# EasyEDA Pro project ax08.eprj, board ax08 lite
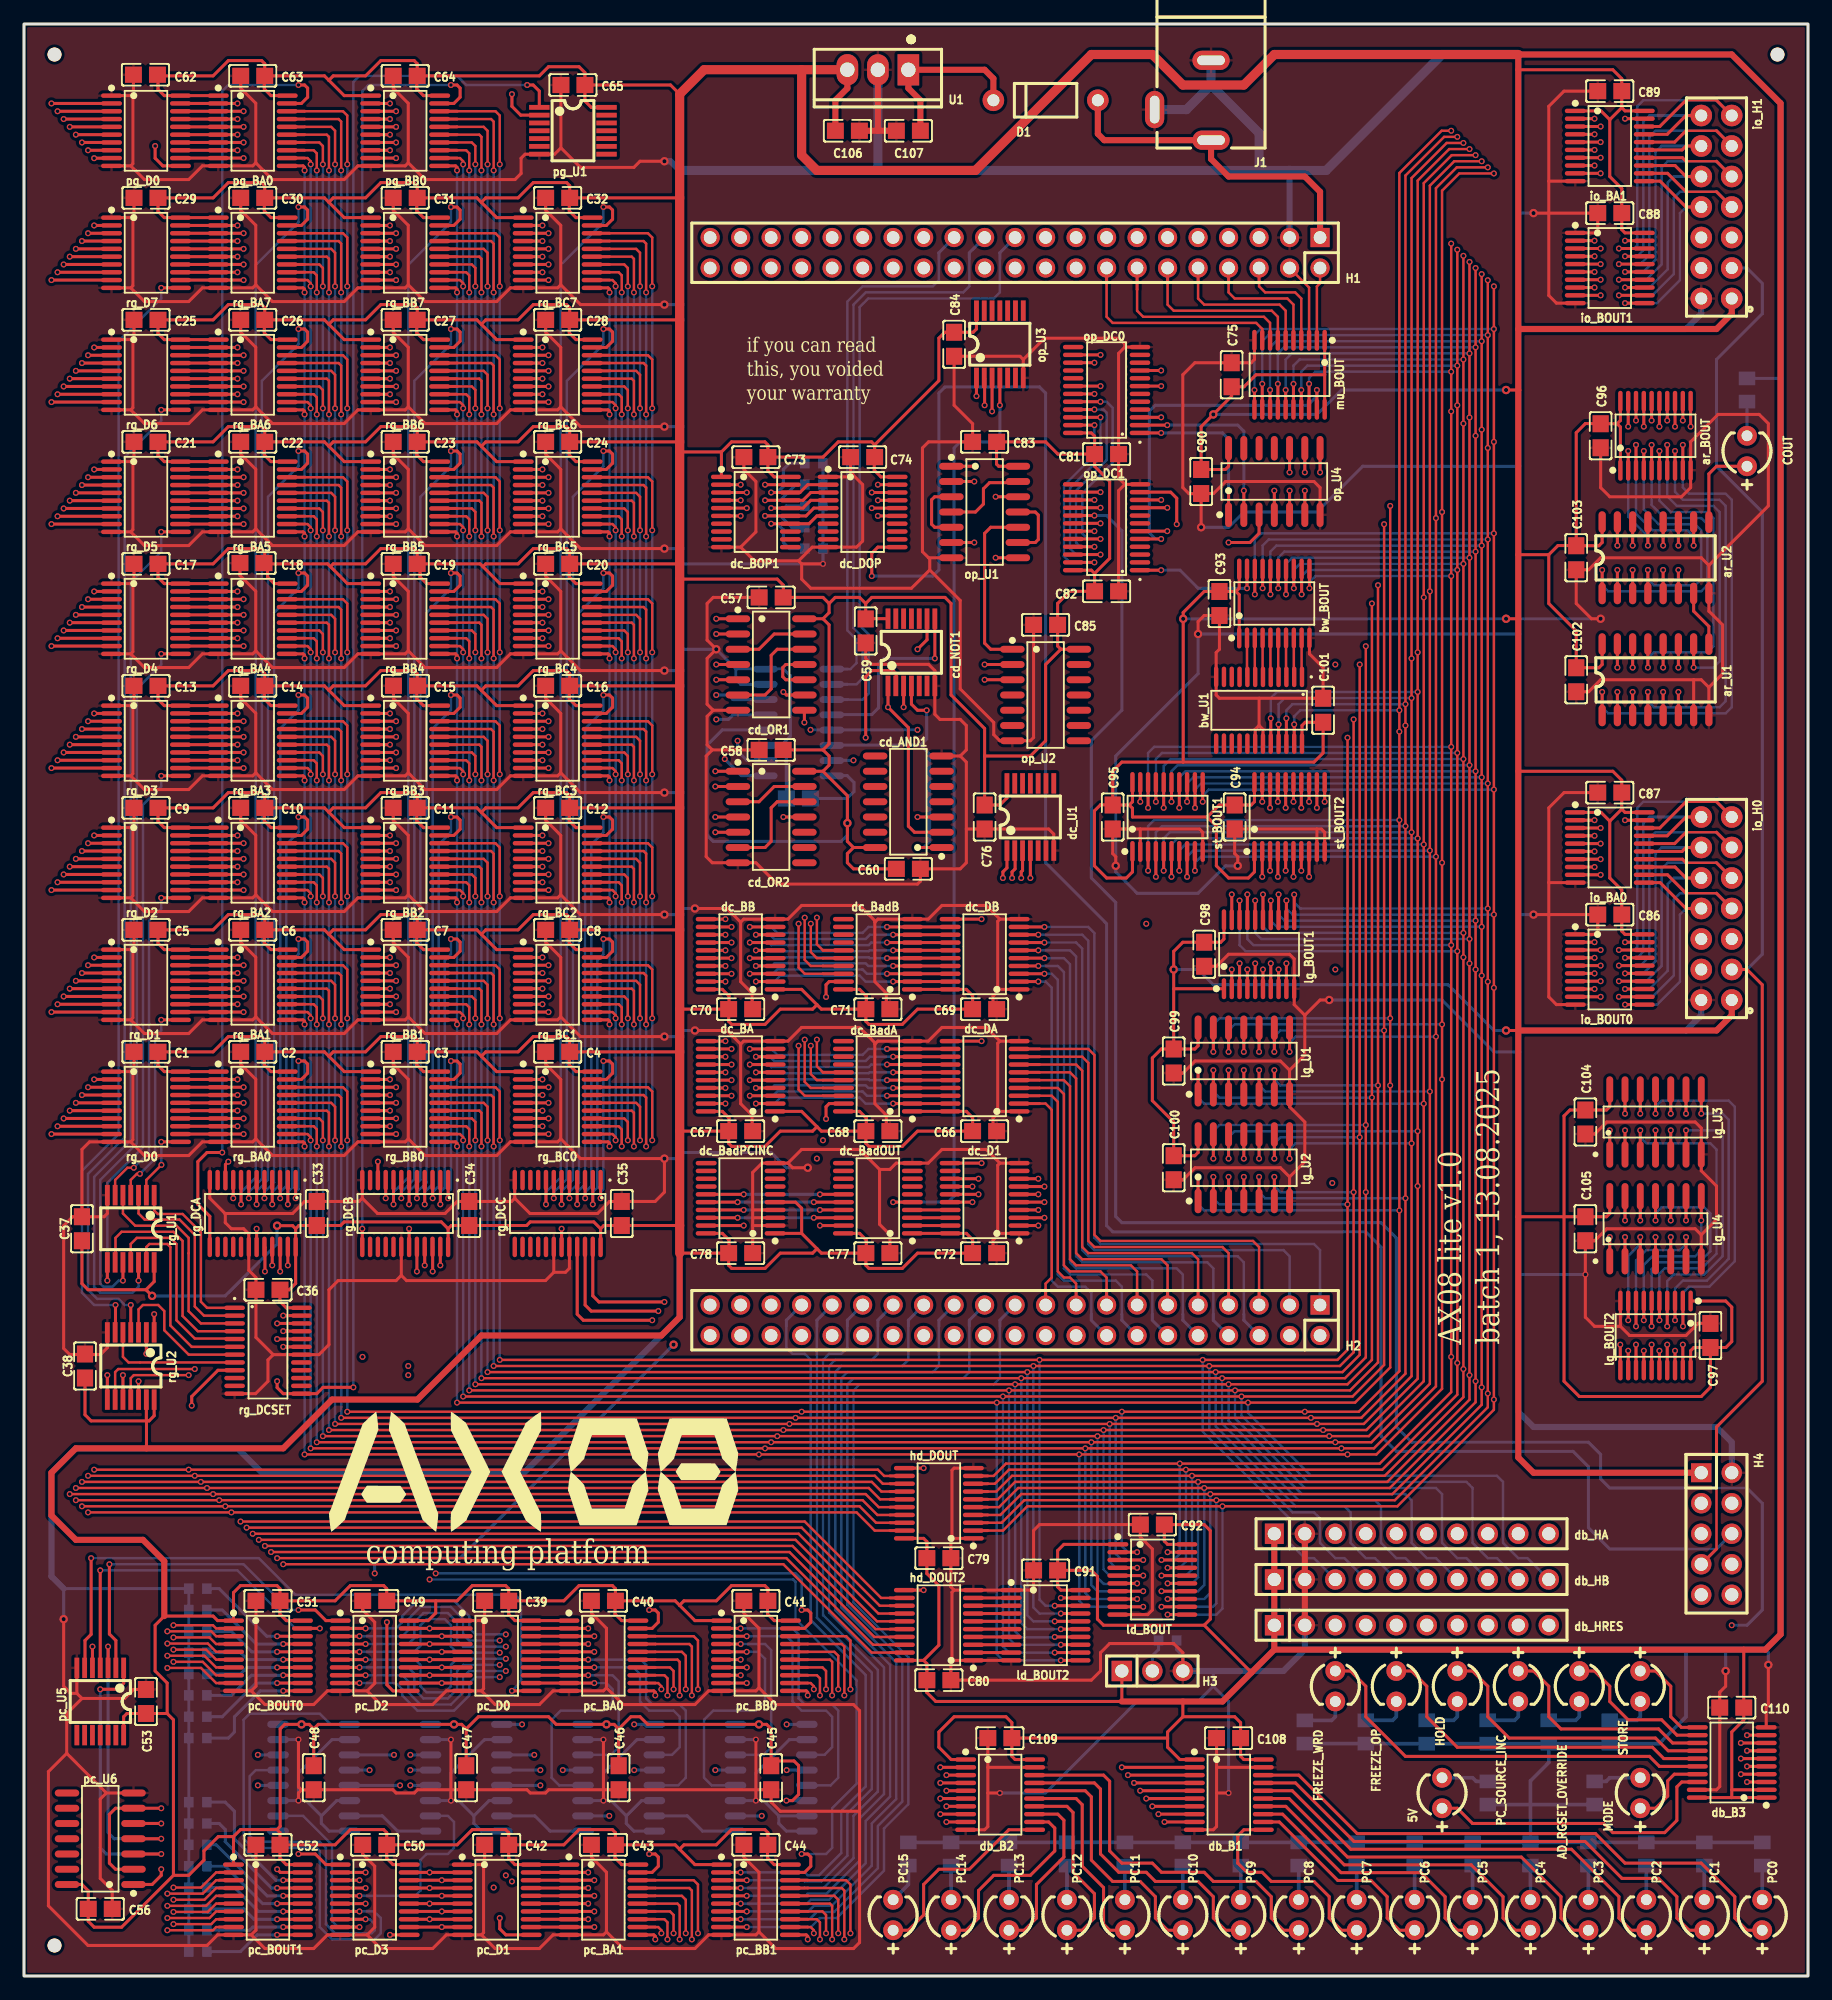
[diagram p43: board, top side]
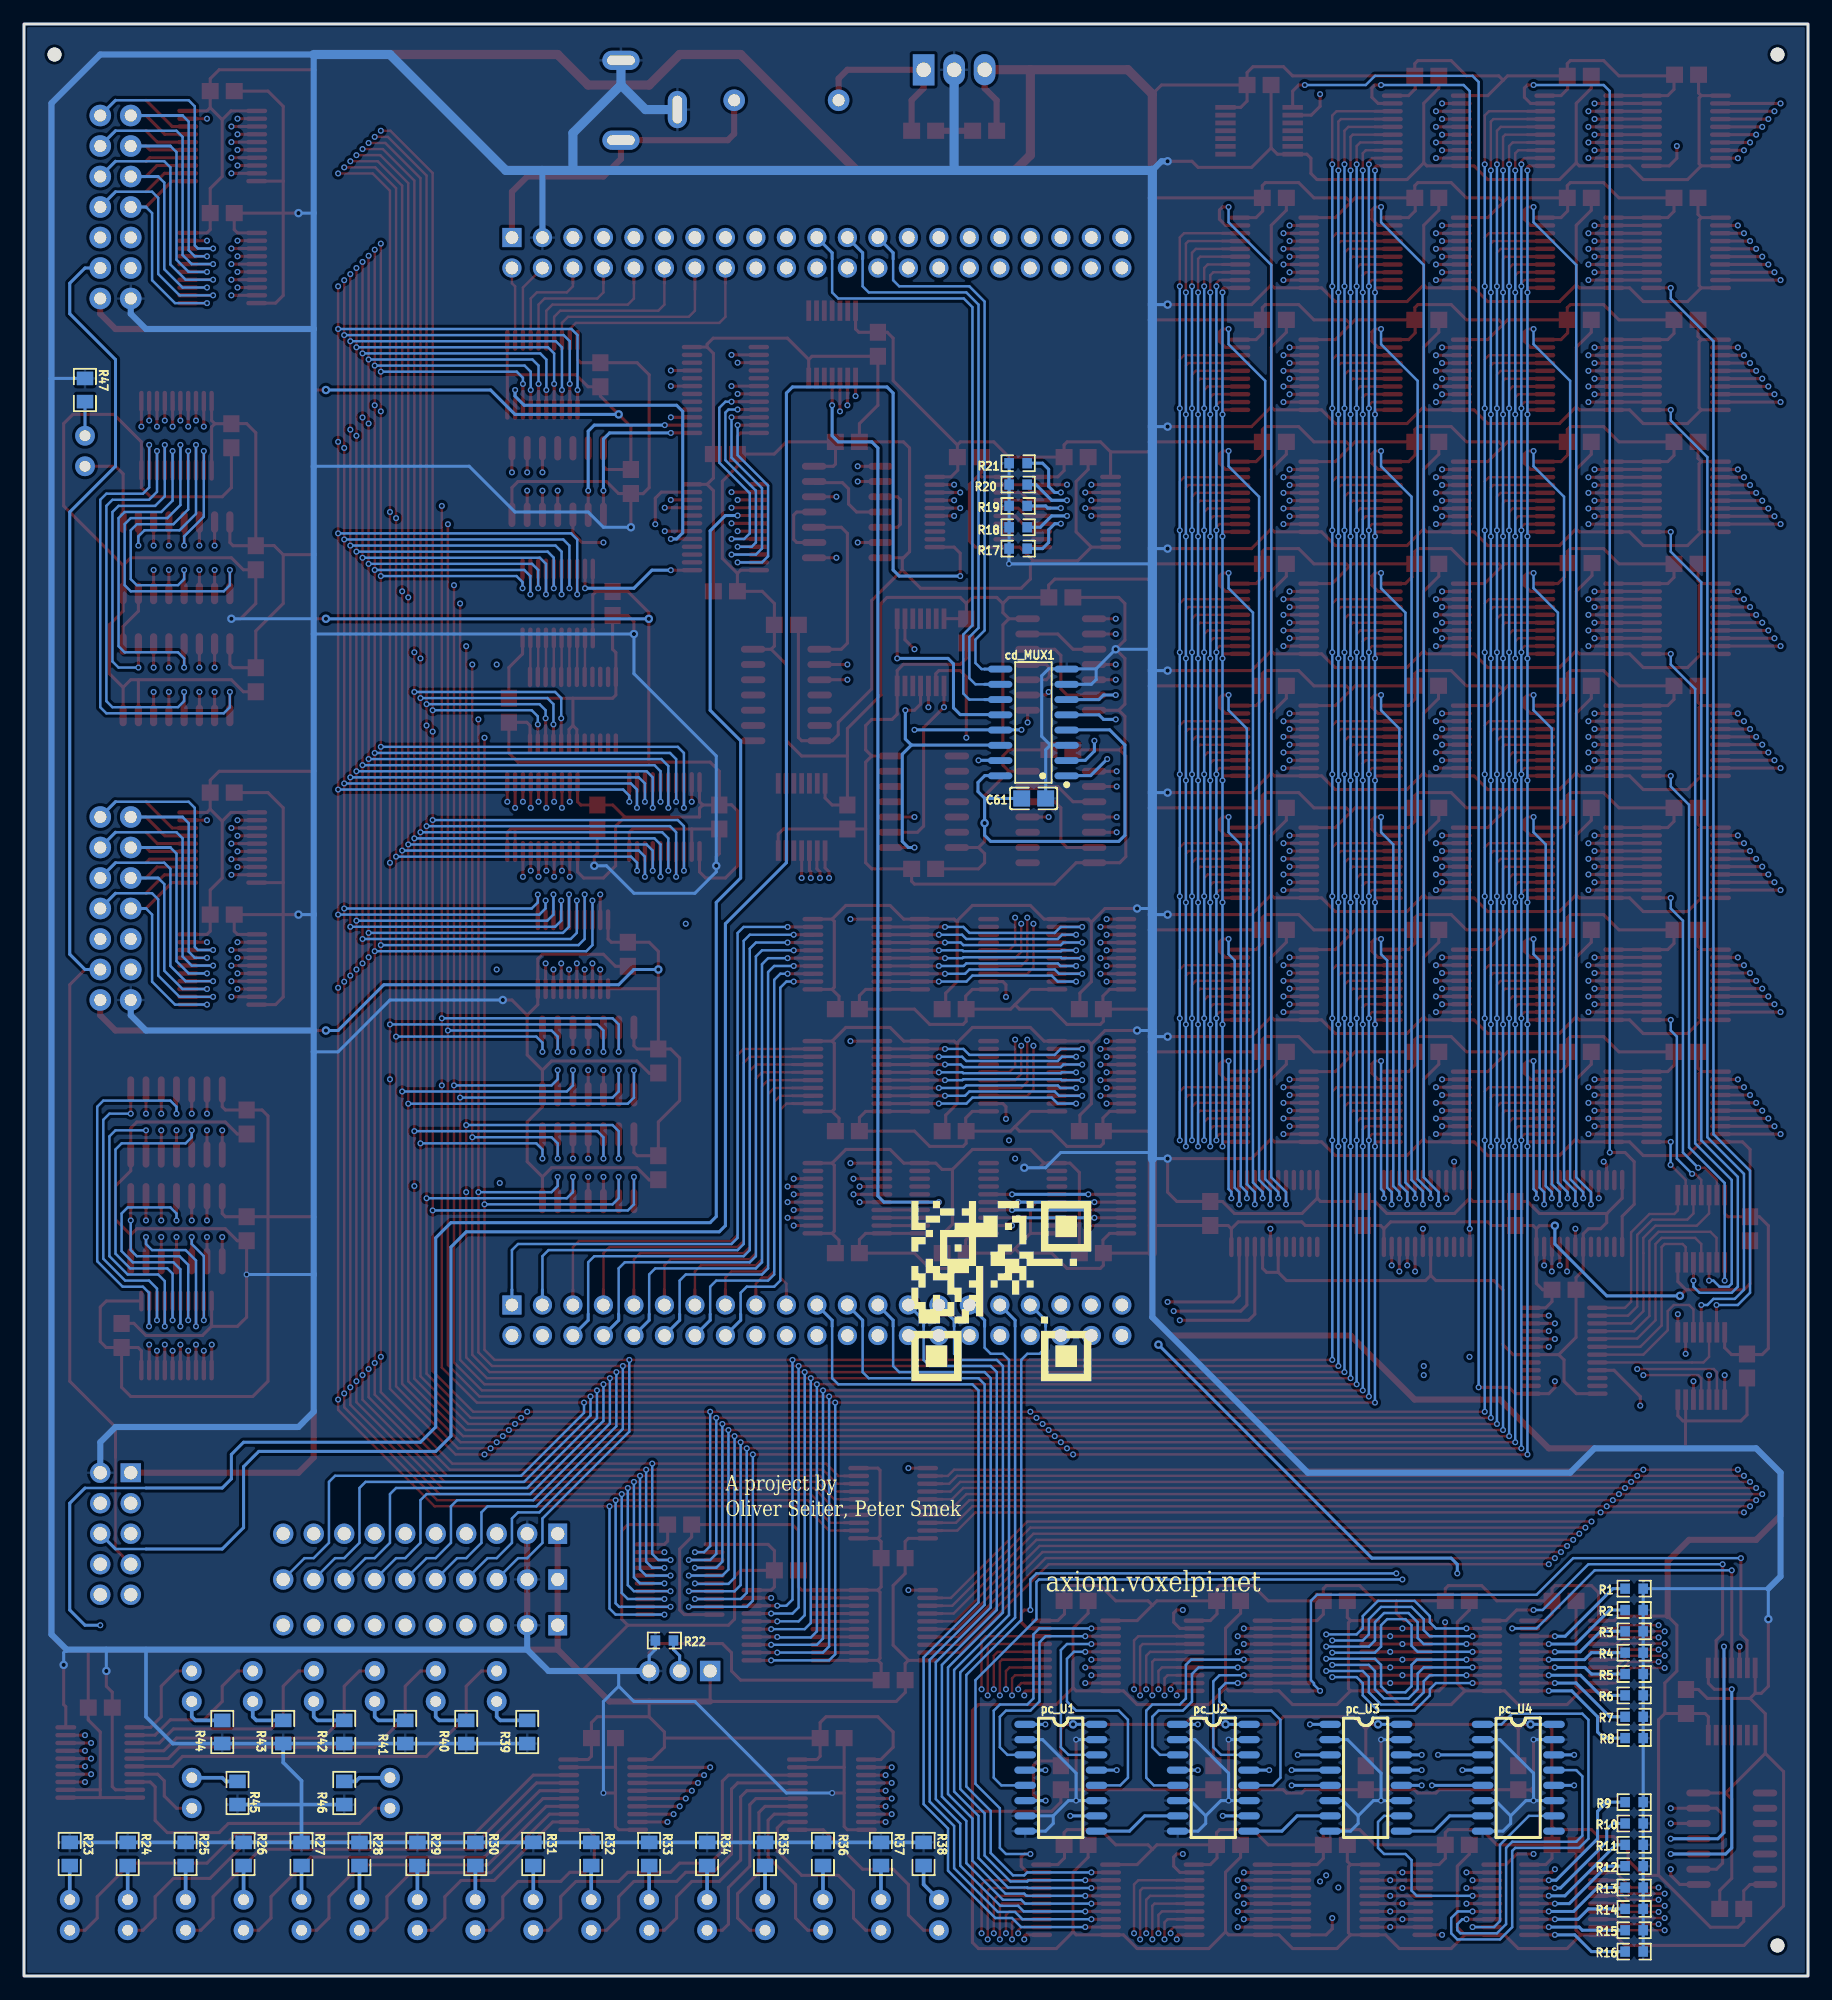
[diagram p44: board, bottom side, seen from below]

Outline 148.59 x 162.56 mm; copper layers: Top Layer, Inner1, Inner2, Bottom Layer. Coordinates in mm from the lower left corner of the outline.
Outline path: rectangle 0,162.56 148.59,0
Stack: Top Layer 0.035mm Outer layer thickness 1oz / Dielectric1 0.2104mm 7628 RC49% 8.6mil / Inner1 0.0152mm Inner layer thickness / Dielectric2 1.065mm 1.1mm H/HOZ Copper / Inner2 0.0152mm Inner layer thickness / Dielectric3 0.2104mm 7628 RC49% 8.6mil / Bottom Layer 0.035mm Outer layer thickness 1oz

## Design rules (mm)
template: JLCPCB Capability(Two Layers Board)
spacing copperThickness1oz (default): track to track 0.102, other pairs 0.152 to 0.3
spacing copperThickness2oz: track to track 0.203, other pairs 0.152 to 0.3
track width copperThickness1oz (default): min 0.127, default 0.254, max 2.54
track width copperThickness2oz: min 0.203, default 0.254, max 2.54
differential pair differentialPair (default): width min 0.127, default 0.254, max 2.54; gap min 0.152, default 0.152
via viaSize (default): diameter min 0.5, default 0.61, max 10; hole min 0.3, default 0.305, max 6.3

## Placement (name value [footprint] x y rotation side)
5V  DY-204UYGD-H38-A3  [LED-TH_BD4.0-P2.54-FD]  118.11 15.24 90 top
AD_RGSET_OVERRIDE  DY-204UYGD-H38-A3  [LED-TH_BD4.0-P2.54-FD]  129.54 24.13 270 top
ar_BOUT  74HC245PW,118  [TSSOP-20_L6.5-W4.4-P0.65-LS6.4-BL]  135.89 128.27 0 top
ar_U1  SN74LS283DR(LX)  [SOIC-16_L9.9-W3.9-P1.27-LS6.0-BL-1]  135.89 107.95 0 top
ar_U2  SN74LS283DR(LX)  [SOIC-16_L9.9-W3.9-P1.27-LS6.0-BL-1]  135.89 118.11 0 top
bw_BOUT  74HC245PW,118  [TSSOP-20_L6.5-W4.4-P0.65-LS6.4-BL]  104.14 114.3 0 top
bw_U1  SN74HC154PW(LX)  [TSSOP-24_L7.8-W4.4-P0.65-LS6.4-BL_1]  102.87 105.41 180 top
C1  100nF  [C0805]  10.16 76.96 0 top
C2  100nF  [C0805]  19.05 76.96 0 top
C3  100nF  [C0805]  31.75 76.96 0 top
C4  100nF  [C0805]  44.45 76.96 0 top
C5  100nF  [C0805]  10.16 87.12 0 top
C6  100nF  [C0805]  19.05 87.12 0 top
C7  100nF  [C0805]  31.75 87.12 0 top
C8  100nF  [C0805]  44.45 87.12 0 top
C9  100nF  [C0805]  10.16 97.28 0 top
C10  100nF  [C0805]  19.05 97.28 0 top
C11  100nF  [C0805]  31.75 97.28 0 top
C12  100nF  [C0805]  44.45 97.28 0 top
C13  100nF  [C0805]  10.16 107.44 0 top
C14  100nF  [C0805]  19.05 107.44 0 top
C15  100nF  [C0805]  31.77 107.45 0 top
C16  100nF  [C0805]  44.45 107.44 0 top
C17  100nF  [C0805]  10.16 117.6 0 top
C18  100nF  [C0805]  18.99 117.67 0 top
C19  100nF  [C0805]  31.75 117.6 0 top
C20  100nF  [C0805]  44.45 117.6 0 top
C21  100nF  [C0805]  10.16 127.76 0 top
C22  100nF  [C0805]  19.05 127.76 0 top
C23  100nF  [C0805]  31.75 127.76 0 top
C24  100nF  [C0805]  44.45 127.76 0 top
C25  100nF  [C0805]  10.16 137.92 0 top
C26  100nF  [C0805]  19.05 137.92 0 top
C27  100nF  [C0805]  31.75 137.92 0 top
C28  100nF  [C0805]  44.45 137.92 0 top
C29  100nF  [C0805]  10.16 148.08 0 top
C30  100nF  [C0805]  19.05 148.08 0 top
C31  100nF  [C0805]  31.75 148.08 0 top
C32  100nF  [C0805]  44.45 148.08 0 top
C33  100nF  [C0805]  24.38 63.5 90 top
C34  100nF  [C0805]  37.08 63.5 90 top
C35  100nF  [C0805]  49.78 63.5 90 top
C36  100nF  [C0805]  20.32 57.15 180 top
C37  100nF  [C0805]  4.83 62.23 270 top
C38  100nF  [C0805]  5.08 50.8 270 top
C39  100nF  [C0805]  39.37 31.24 0 top
C40  100nF  [C0805]  48.26 31.24 0 top
C41  100nF  [C0805]  60.96 31.24 0 top
C42  100nF  [C0805]  39.37 10.92 0 top
C43  100nF  [C0805]  48.26 10.92 0 top
C44  100nF  [C0805]  60.96 10.92 0 top
C45  100nF  [C0805]  62.23 16.51 90 top
C46  100nF  [C0805]  49.53 16.51 90 top
C47  100nF  [C0805]  36.83 16.51 90 top
C48  100nF  [C0805]  24.13 16.51 90 top
C49  100nF  [C0805]  29.21 31.24 0 top
C50  100nF  [C0805]  29.21 10.92 0 top
C51  100nF  [C0805]  20.32 31.24 0 top
C52  100nF  [C0805]  20.32 10.92 0 top
C53  100nF  [C0805]  10.16 22.86 270 top
C56  100nF  [C0805]  6.35 5.59 180 top
C57  100nF  [C0805]  62.23 114.81 0 top
C58  100nF  [C0805]  62.23 102.11 0 top
C59  100nF  [C0805]  70.1 112.01 90 top
C60  100nF  [C0805]  73.66 92.2 180 top
C61  100nF  [C0805]  64.5 98.06 0 bottom
C62  100nF  [C0805]  10.11 158.34 0 top
C63  100nF  [C0805]  19.05 158.24 0 top
C64  100nF  [C0805]  31.75 158.24 0 top
C65  100nF  [C0805]  45.72 157.48 0 top
C66  100nF  [C0805]  80.01 70.36 180 top
C67  100nF  [C0805]  59.69 70.36 180 top
C68  100nF  [C0805]  71.12 70.36 180 top
C69  100nF  [C0805]  80.01 80.52 180 top
C70  100nF  [C0805]  59.69 80.52 180 top
C71  100nF  [C0805]  71.12 80.52 180 top
C72  100nF  [C0805]  80.01 60.2 180 top
C73  100nF  [C0805]  60.96 126.49 0 top
C74  100nF  [C0805]  69.85 126.49 0 top
C75  100nF  [C0805]  100.58 133.35 270 top
C76  100nF  [C0805]  80.01 96.52 90 top
C77  100nF  [C0805]  71.12 60.2 180 top
C78  100nF  [C0805]  59.69 60.2 180 top
C79  100nF  [C0805]  76.2 34.8 180 top
C80  100nF  [C0805]  76.2 24.64 180 top
C81  100nF  [C0805]  90.17 126.75 0 top
C82  100nF  [C0805]  90.17 115.32 0 top
C83  100nF  [C0805]  80.01 127.76 0 top
C84  100nF  [C0805]  77.47 135.89 90 top
C85  100nF  [C0805]  85.09 112.52 0 top
C86  100nF  [C0805]  132.08 88.39 0 top
C87  100nF  [C0805]  132.08 98.55 0 top
C88  100nF  [C0805]  132.08 146.81 0 top
C89  100nF  [C0805]  132.08 156.97 0 top
C90  100nF  [C0805]  98.04 124.46 90 top
C91  100nF  [C0805]  85.09 33.78 0 top
C92  100nF  [C0805]  93.98 37.59 0 top
C93  100nF  [C0805]  99.57 114.3 90 top
C94  100nF  [C0805]  100.84 96.52 90 top
C95  100nF  [C0805]  90.68 96.52 90 top
C96  100nF  [C0805]  131.32 128.27 90 top
C97  100nF  [C0805]  140.46 53.34 270 top
C98  100nF  [C0805]  98.3 85.09 90 top
C99  100nF  [C0805]  95.76 76.2 90 top
C100  100nF  [C0805]  95.76 67.31 90 top
C101  100nF  [C0805]  108.2 105.41 90 top
C102  100nF  [C0805]  129.29 107.95 90 top
C103  100nF  [C0805]  129.29 118.11 90 top
C104  100nF  [C0805]  130.05 71.12 90 top
C105  100nF  [C0805]  130.05 62.23 90 top
C106  100nF  [C0805]  68.58 153.67 180 top
C107  100nF  [C0805]  73.66 153.67 180 top
C108  100nF  [C0805]  100.33 19.81 0 top
C109  100nF  [C0805]  81.28 19.81 0 top
C110  100nF  [C0805]  142.24 22.35 0 top
cd_AND1  MC14081BDR2G  [SOIC-14_L8.7-W3.9-P1.27-LS6.0-BL]  73.66 97.79 90 top
cd_MUX1  SN74LS151DR(LX)  [SOP-16_L9.9-W3.9-P1.27-LS6.0-BL]  64.52 104.39 90 bottom
cd_NOT1  74HC14PW,118  [TSSOP-14_L5.0-W4.4-P0.65-LS6.4-BL]  73.91 110.24 0 top
cd_OR1  SN74HC32DR  [SOIC-14_L8.7-W3.9-P1.27-LS6.0-BL]  62.23 109.22 270 top
cd_OR2  SN74HC32DR  [SOIC-14_L8.7-W3.9-P1.27-LS6.0-BL]  62.23 96.52 270 top
COUT  DY-204UYGD-H38-A3  [LED-TH_BD4.0-P2.54-FD]  143.51 127 90 top
D1  1N5819  [DO-41_BD2.4-L4.7-P8.70-D0.9-RD]  85.09 156.21 0 top
db_B1  74HC245PW,118  [TSSOP-20_L6.5-W4.4-P0.65-LS6.4-BL]  100.35 15.1 270 top
db_B2  74HC245PW,118  [TSSOP-20_L6.5-W4.4-P0.65-LS6.4-BL]  81.3 15.1 270 top
db_B3  74HC245PW,118  [TSSOP-20_L6.5-W4.4-P0.65-LS6.4-BL]  142.24 17.78 90 top
db_HA  PM254-1-10-Z-8.5  [HDR-TH_10P-P2.54-V-F]  115.57 36.83 0 top
db_HB  PM254-1-10-Z-8.5  [HDR-TH_10P-P2.54-V-F]  115.57 33.02 0 top
db_HRES  PM254-1-10-Z-8.5  [HDR-TH_10P-P2.54-V-F]  115.57 29.21 0 top
dc_BA  74HC245PW,118  [TSSOP-20_L6.5-W4.4-P0.65-LS6.4-BL]  59.69 74.93 90 top
dc_BadA  74HC245PW,118  [TSSOP-20_L6.5-W4.4-P0.65-LS6.4-BL]  71.12 74.93 90 top
dc_BadB  74HC245PW,118  [TSSOP-20_L6.5-W4.4-P0.65-LS6.4-BL]  71.12 85.09 90 top
dc_BadOUT  74HC245PW,118  [TSSOP-20_L6.5-W4.4-P0.65-LS6.4-BL]  71.12 64.77 90 top
dc_BadPCINC  74HC245PW,118  [TSSOP-20_L6.5-W4.4-P0.65-LS6.4-BL]  59.69 64.77 90 top
dc_BB  74HC245PW,118  [TSSOP-20_L6.5-W4.4-P0.65-LS6.4-BL]  59.69 85.09 90 top
dc_BOP1  74HC245PW,118  [TSSOP-20_L6.5-W4.4-P0.65-LS6.4-BL]  60.96 121.92 270 top
dc_D1  74HC574PW,118  [TSSOP-20_L6.5-W4.4-P0.65-LS6.4-BL]  80.01 64.77 90 top
dc_DA  74HC574PW,118  [TSSOP-20_L6.5-W4.4-P0.65-LS6.4-BL]  80.01 74.93 90 top
dc_DB  74HC574PW,118  [TSSOP-20_L6.5-W4.4-P0.65-LS6.4-BL]  80.01 85.09 90 top
dc_DOP  74HC574PW,118  [TSSOP-20_L6.5-W4.4-P0.65-LS6.4-BL]  69.85 121.92 270 top
dc_U1  74HC14PW,118  [TSSOP-14_L5.0-W4.4-P0.65-LS6.4-BL]  83.82 96.52 0 top
FREEZE_OP  DY-204UYGD-H38-A3  [LED-TH_BD4.0-P2.54-FD]  114.3 24.13 270 top
FREEZE_WRD  DY-204UYGD-H38-A3  [LED-TH_BD4.0-P2.54-FD]  109.22 24.13 270 top
H1  FH-00008  [HDR-TH_42P-P2.54-V-F-R2-C21-S2.54-1]  82.55 143.51 180 top
H2  FH-00008  [HDR-TH_42P-P2.54-V-F-R2-C21-S2.54-1]  82.55 54.61 180 top
H3  PZ254V-11-03P  [HDR-TH_3P-P2.54-V-M]  93.98 25.4 0 top
H4  PM254V-12-10P-H85  [HDR-TH_10P-P2.54-V-F-R2-C5-S2.54]  140.97 36.83 270 top
hd_DOUT  74HC574PW,118  [TSSOP-20_L6.5-W4.4-P0.65-LS6.4-BL]  76.2 39.37 90 top
hd_DOUT2  74HC574PW,118  [TSSOP-20_L6.5-W4.4-P0.65-LS6.4-BL]  76.2 29.21 90 top
HOLD  DY-204UYGD-H38-A3  [LED-TH_BD4.0-P2.54-FD]  119.38 24.13 270 top
io_BA0  74HC245PW,118  [TSSOP-20_L6.5-W4.4-P0.65-LS6.4-BL]  132.08 93.98 270 top
io_BA1  74HC245PW,118  [TSSOP-20_L6.5-W4.4-P0.65-LS6.4-BL]  132.08 152.4 270 top
io_BOUT0  74HC245PW,118  [TSSOP-20_L6.5-W4.4-P0.65-LS6.4-BL]  132.08 83.82 270 top
io_BOUT1  74HC245PW,118  [TSSOP-20_L6.5-W4.4-P0.65-LS6.4-BL]  132.08 142.24 270 top
io_H0  PM254-2-07-Z-8.5  [HDR-TH_14P-P2.54-V-F-R2-C7-S2.54]  140.97 88.9 90 top
io_H1  PM254-2-07-Z-8.5  [HDR-TH_14P-P2.54-V-F-R2-C7-S2.54]  140.97 147.32 90 top
J1  DC-005C-20A  [DC-IN-TH_DC-005C-20A]  96.52 156.21 270 top
ld_BOUT  74HC245PW,118  [TSSOP-20_L6.5-W4.4-P0.65-LS6.4-BL]  93.98 33.02 270 top
ld_BOUT2  74HC245PW,118  [TSSOP-20_L6.5-W4.4-P0.65-LS6.4-BL]  85.09 29.21 270 top
lg_BOUT1  74HC245PW,118  [TSSOP-20_L6.5-W4.4-P0.65-LS6.4-BL]  102.87 85.09 0 top
lg_BOUT2  74HC245PW,118  [TSSOP-20_L6.5-W4.4-P0.65-LS6.4-BL]  135.89 53.34 180 top
lg_U1  MC14081BDR2G  [SOIC-14_L8.7-W3.9-P1.27-LS6.0-BL]  101.6 76.2 0 top
lg_U2  MC14081BDR2G  [SOIC-14_L8.7-W3.9-P1.27-LS6.0-BL]  101.6 67.31 0 top
lg_U3  SN74HC86DR(LX)  [SOP-14_L8.5-W3.8-P1.27-LS6.2-BL]  135.89 71.12 0 top
lg_U4  SN74HC86DR(LX)  [SOP-14_L8.5-W3.8-P1.27-LS6.2-BL]  135.89 62.23 0 top
MODE  DY-204UYGD-H38-A3  [LED-TH_BD4.0-P2.54-FD]  134.62 15.24 90 top
mu_BOUT  74HC245PW,118  [TSSOP-20_L6.5-W4.4-P0.65-LS6.4-BL]  105.41 133.35 180 top
NOREF  -  [Pad_e773]  2.54 2.54 0 top
NOREF#2  -  [Pad_e1084]  146.05 160.02 0 top
NOREF#3  -  [Pad_e1083]  2.54 160.02 0 top
op_DC0  SN74HC154PW(LX)  [TSSOP-24_L7.8-W4.4-P0.65-LS6.4-BL_1]  90.17 132.08 90 top
op_DC1  SN74HC154PW(LX)  [TSSOP-24_L7.8-W4.4-P0.65-LS6.4-BL_1]  90.17 120.65 90 top
op_U1  MC14081BDR2G  [SOIC-14_L8.7-W3.9-P1.27-LS6.0-BL]  80.01 121.92 270 top
op_U2  SN74HC32DR  [SOIC-14_L8.7-W3.9-P1.27-LS6.0-BL]  85.09 106.68 270 top
op_U3  74HC14PW,118  [TSSOP-14_L5.0-W4.4-P0.65-LS6.4-BL]  81.28 135.89 0 top
op_U4  MC14081BDR2G  [SOIC-14_L8.7-W3.9-P1.27-LS6.0-BL]  104.14 124.46 0 top
PC0  DY-204UYGD-H38-A3  [LED-TH_BD4.0-P2.54-FD]  144.78 5.08 90 top
PC1  DY-204UYGD-H38-A3  [LED-TH_BD4.0-P2.54-FD]  139.95 5.08 90 top
PC2  DY-204UYGD-H38-A3  [LED-TH_BD4.0-P2.54-FD]  135.13 5.08 90 top
PC3  DY-204UYGD-H38-A3  [LED-TH_BD4.0-P2.54-FD]  130.3 5.08 90 top
PC4  DY-204UYGD-H38-A3  [LED-TH_BD4.0-P2.54-FD]  125.48 5.08 90 top
PC5  DY-204UYGD-H38-A3  [LED-TH_BD4.0-P2.54-FD]  120.65 5.08 90 top
PC6  DY-204UYGD-H38-A3  [LED-TH_BD4.0-P2.54-FD]  115.82 5.08 90 top
PC7  DY-204UYGD-H38-A3  [LED-TH_BD4.0-P2.54-FD]  111 5.08 90 top
PC8  DY-204UYGD-H38-A3  [LED-TH_BD4.0-P2.54-FD]  106.17 5.08 90 top
PC9  DY-204UYGD-H38-A3  [LED-TH_BD4.0-P2.54-FD]  101.35 5.08 90 top
PC10  DY-204UYGD-H38-A3  [LED-TH_BD4.0-P2.54-FD]  96.52 5.08 90 top
PC11  DY-204UYGD-H38-A3  [LED-TH_BD4.0-P2.54-FD]  91.69 5.08 90 top
PC12  DY-204UYGD-H38-A3  [LED-TH_BD4.0-P2.54-FD]  86.87 5.08 90 top
PC13  DY-204UYGD-H38-A3  [LED-TH_BD4.0-P2.54-FD]  82.04 5.08 90 top
PC14  DY-204UYGD-H38-A3  [LED-TH_BD4.0-P2.54-FD]  77.22 5.08 90 top
PC15  DY-204UYGD-H38-A3  [LED-TH_BD4.0-P2.54-FD]  72.39 5.08 90 top
pc_BA0  74HC245PW,118  [TSSOP-20_L6.5-W4.4-P0.65-LS6.4-BL]  48.26 26.67 270 top
pc_BA1  74HC245PW,118  [TSSOP-20_L6.5-W4.4-P0.65-LS6.4-BL]  48.26 6.35 270 top
pc_BB0  74HC245PW,118  [TSSOP-20_L6.5-W4.4-P0.65-LS6.4-BL]  60.96 26.67 270 top
pc_BB1  74HC245PW,118  [TSSOP-20_L6.5-W4.4-P0.65-LS6.4-BL]  60.96 6.35 270 top
pc_BOUT0  74HC245PW,118  [TSSOP-20_L6.5-W4.4-P0.65-LS6.4-BL]  20.32 26.67 270 top
pc_BOUT1  74HC245PW,118  [TSSOP-20_L6.5-W4.4-P0.65-LS6.4-BL]  20.32 6.35 270 top
pc_D0  74HC574PW,118  [TSSOP-20_L6.5-W4.4-P0.65-LS6.4-BL]  39.37 26.67 270 top
pc_D1  74HC574PW,118  [TSSOP-20_L6.5-W4.4-P0.65-LS6.4-BL]  39.37 6.35 270 top
pc_D2  74HC574PW,118  [TSSOP-20_L6.5-W4.4-P0.65-LS6.4-BL]  29.21 26.67 270 top
pc_D3  74HC574PW,118  [TSSOP-20_L6.5-W4.4-P0.65-LS6.4-BL]  29.21 6.35 270 top
PC_SOURCE_INC  DY-204UYGD-H38-A3  [LED-TH_BD4.0-P2.54-FD]  124.46 24.13 270 top
pc_U1  SN74LS283DR(LX)  [SOIC-16_L9.9-W3.9-P1.27-LS6.0-BL-1]  62.23 16.51 270 bottom
pc_U2  SN74LS283DR(LX)  [SOIC-16_L9.9-W3.9-P1.27-LS6.0-BL-1]  49.53 16.51 270 bottom
pc_U3  SN74LS283DR(LX)  [SOIC-16_L9.9-W3.9-P1.27-LS6.0-BL-1]  36.83 16.51 270 bottom
pc_U4  SN74LS283DR(LX)  [SOIC-16_L9.9-W3.9-P1.27-LS6.0-BL-1]  24.13 16.51 270 bottom
pc_U5  74HC14PW,118  [TSSOP-14_L5.0-W4.4-P0.65-LS6.4-BL]  6.35 22.86 180 top
pc_U6  MC14081BDR2G  [SOIC-14_L8.7-W3.9-P1.27-LS6.0-BL]  6.35 11.43 90 top
pg_BA0  74HC245PW,118  [TSSOP-20_L6.5-W4.4-P0.65-LS6.4-BL]  19.05 153.67 270 top
pg_BB0  74HC245PW,118  [TSSOP-20_L6.5-W4.4-P0.65-LS6.4-BL]  31.75 153.67 270 top
pg_D0  74HC574PW,118  [TSSOP-20_L6.5-W4.4-P0.65-LS6.4-BL]  10.16 153.67 270 top
pg_U1  74HC14PW,118  [TSSOP-14_L5.0-W4.4-P0.65-LS6.4-BL]  45.72 153.67 270 top
R1  47kΩ  [R0603]  14.48 32.26 180 bottom
R2  47kΩ  [R0603]  14.48 30.48 180 bottom
R3  47kΩ  [R0603]  14.48 28.7 180 bottom
R4  47kΩ  [R0603]  14.48 26.92 180 bottom
R5  47kΩ  [R0603]  14.48 25.15 180 bottom
R6  47kΩ  [R0603]  14.48 23.37 180 bottom
R7  47kΩ  [R0603]  14.48 21.59 180 bottom
R8  47kΩ  [R0603]  14.48 19.81 180 bottom
R9  47kΩ  [R0603]  14.48 14.48 180 bottom
R10  47kΩ  [R0603]  14.48 12.7 180 bottom
R11  47kΩ  [R0603]  14.48 10.92 180 bottom
R12  47kΩ  [R0603]  14.48 9.14 180 bottom
R13  47kΩ  [R0603]  14.48 7.37 180 bottom
R14  47kΩ  [R0603]  14.48 5.59 180 bottom
R15  47kΩ  [R0603]  14.48 3.81 180 bottom
R16  47kΩ  [R0603]  14.48 2.03 180 bottom
R17  47kΩ  [R0603]  65.79 118.87 180 bottom
R18  47kΩ  [R0603]  65.79 120.65 180 bottom
R19  47kΩ  [R0603]  65.79 122.43 180 bottom
R20  47kΩ  [R0603]  65.79 124.21 180 bottom
R21  47kΩ  [R0603]  65.79 125.98 180 bottom
R22  47kΩ  [R0603]  95.25 27.94 0 bottom
R23  2K  [R0805_1]  144.78 10.16 270 bottom
R24  2K  [R0805_1]  139.95 10.16 270 bottom
R25  2K  [R0805_1]  135.13 10.16 270 bottom
R26  2K  [R0805_1]  130.3 10.16 270 bottom
R27  2K  [R0805_1]  125.48 10.16 270 bottom
R28  2K  [R0805_1]  120.65 10.16 270 bottom
R29  2K  [R0805_1]  115.82 10.16 270 bottom
R30  2K  [R0805_1]  111 10.16 270 bottom
R31  2K  [R0805_1]  106.17 10.16 270 bottom
R32  2K  [R0805_1]  101.35 10.16 270 bottom
R33  2K  [R0805_1]  96.52 10.16 270 bottom
R34  2K  [R0805_1]  91.69 10.16 270 bottom
R35  2K  [R0805_1]  86.87 10.16 270 bottom
R36  2K  [R0805_1]  82.04 10.16 270 bottom
R37  2K  [R0805_1]  77.22 10.16 270 bottom
R38  2K  [R0805_1]  73.66 10.16 270 bottom
R39  2K  [R0805_1]  106.68 20.32 90 bottom
R40  2K  [R0805_1]  111.76 20.32 90 bottom
R41  2K  [R0805_1]  116.84 20.32 90 bottom
R42  2K  [R0805_1]  121.92 20.32 90 bottom
R43  2K  [R0805_1]  127 20.32 90 bottom
R44  2K  [R0805_1]  132.08 20.32 90 bottom
R45  2K  [R0805_1]  130.81 15.24 90 bottom
R46  2K  [R0805_1]  121.92 15.24 90 bottom
R47  2K  [R0805_1]  143.51 132.08 270 bottom
rg_BA0  74HC245PW,118  [TSSOP-20_L6.5-W4.4-P0.65-LS6.4-BL]  19.05 72.39 270 top
rg_BA1  74HC245PW,118  [TSSOP-20_L6.5-W4.4-P0.65-LS6.4-BL]  19.05 82.55 270 top
rg_BA2  74HC245PW,118  [TSSOP-20_L6.5-W4.4-P0.65-LS6.4-BL]  19.05 92.71 270 top
rg_BA3  74HC245PW,118  [TSSOP-20_L6.5-W4.4-P0.65-LS6.4-BL]  19.05 102.87 270 top
rg_BA4  74HC245PW,118  [TSSOP-20_L6.5-W4.4-P0.65-LS6.4-BL]  19.05 113.03 270 top
rg_BA5  74HC245PW,118  [TSSOP-20_L6.5-W4.4-P0.65-LS6.4-BL]  19.05 123.19 270 top
rg_BA6  74HC245PW,118  [TSSOP-20_L6.5-W4.4-P0.65-LS6.4-BL]  19.05 133.35 270 top
rg_BA7  74HC245PW,118  [TSSOP-20_L6.5-W4.4-P0.65-LS6.4-BL]  19.05 143.51 270 top
rg_BB0  74HC245PW,118  [TSSOP-20_L6.5-W4.4-P0.65-LS6.4-BL]  31.75 72.39 270 top
rg_BB1  74HC245PW,118  [TSSOP-20_L6.5-W4.4-P0.65-LS6.4-BL]  31.75 82.55 270 top
rg_BB2  74HC245PW,118  [TSSOP-20_L6.5-W4.4-P0.65-LS6.4-BL]  31.75 92.71 270 top
rg_BB3  74HC245PW,118  [TSSOP-20_L6.5-W4.4-P0.65-LS6.4-BL]  31.75 102.87 270 top
rg_BB4  74HC245PW,118  [TSSOP-20_L6.5-W4.4-P0.65-LS6.4-BL]  31.75 113.03 270 top
rg_BB5  74HC245PW,118  [TSSOP-20_L6.5-W4.4-P0.65-LS6.4-BL]  31.75 123.19 270 top
rg_BB6  74HC245PW,118  [TSSOP-20_L6.5-W4.4-P0.65-LS6.4-BL]  31.75 133.35 270 top
rg_BB7  74HC245PW,118  [TSSOP-20_L6.5-W4.4-P0.65-LS6.4-BL]  31.75 143.51 270 top
rg_BC0  74HC245PW,118  [TSSOP-20_L6.5-W4.4-P0.65-LS6.4-BL]  44.45 72.39 270 top
rg_BC1  74HC245PW,118  [TSSOP-20_L6.5-W4.4-P0.65-LS6.4-BL]  44.45 82.55 270 top
rg_BC2  74HC245PW,118  [TSSOP-20_L6.5-W4.4-P0.65-LS6.4-BL]  44.45 92.71 270 top
rg_BC3  74HC245PW,118  [TSSOP-20_L6.5-W4.4-P0.65-LS6.4-BL]  44.45 102.87 270 top
rg_BC4  74HC245PW,118  [TSSOP-20_L6.5-W4.4-P0.65-LS6.4-BL]  44.45 113.03 270 top
rg_BC5  74HC245PW,118  [TSSOP-20_L6.5-W4.4-P0.65-LS6.4-BL]  44.45 123.19 270 top
rg_BC6  74HC245PW,118  [TSSOP-20_L6.5-W4.4-P0.65-LS6.4-BL]  44.45 133.35 270 top
rg_BC7  74HC245PW,118  [TSSOP-20_L6.5-W4.4-P0.65-LS6.4-BL]  44.45 143.51 270 top
rg_D0  74HC574PW,118  [TSSOP-20_L6.5-W4.4-P0.65-LS6.4-BL]  10.16 72.39 270 top
rg_D1  74HC574PW,118  [TSSOP-20_L6.5-W4.4-P0.65-LS6.4-BL]  10.16 82.55 270 top
rg_D2  74HC574PW,118  [TSSOP-20_L6.5-W4.4-P0.65-LS6.4-BL]  10.16 92.71 270 top
rg_D3  74HC574PW,118  [TSSOP-20_L6.5-W4.4-P0.65-LS6.4-BL]  10.16 102.87 270 top
rg_D4  74HC574PW,118  [TSSOP-20_L6.5-W4.4-P0.65-LS6.4-BL]  10.16 113.03 270 top
rg_D5  74HC574PW,118  [TSSOP-20_L6.5-W4.4-P0.65-LS6.4-BL]  10.16 123.19 270 top
rg_D6  74HC574PW,118  [TSSOP-20_L6.5-W4.4-P0.65-LS6.4-BL]  10.16 133.35 270 top
rg_D7  74HC574PW,118  [TSSOP-20_L6.5-W4.4-P0.65-LS6.4-BL]  10.16 143.51 270 top
rg_DCA  SN74HC154PW(LX)  [TSSOP-24_L7.8-W4.4-P0.65-LS6.4-BL_1]  19.05 63.5 180 top
rg_DCB  SN74HC154PW(LX)  [TSSOP-24_L7.8-W4.4-P0.65-LS6.4-BL_1]  31.75 63.5 180 top
rg_DCC  SN74HC154PW(LX)  [TSSOP-24_L7.8-W4.4-P0.65-LS6.4-BL_1]  44.45 63.5 180 top
rg_DCSET  SN74HC154PW(LX)  [TSSOP-24_L7.8-W4.4-P0.65-LS6.4-BL_1]  20.32 52.07 270 top
rg_U1  74HC14PW,118  [TSSOP-14_L5.0-W4.4-P0.65-LS6.4-BL]  8.89 62.23 180 top
rg_U2  74HC14PW,118  [TSSOP-14_L5.0-W4.4-P0.65-LS6.4-BL]  8.89 50.8 180 top
st_BOUT1  74HC245PW,118  [TSSOP-20_L6.5-W4.4-P0.65-LS6.4-BL]  95.25 96.52 0 top
st_BOUT2  74HC245PW,118  [TSSOP-20_L6.5-W4.4-P0.65-LS6.4-BL]  105.41 96.52 0 top
STORE  DY-204UYGD-H38-A3  [LED-TH_BD4.0-P2.54-FD]  134.62 24.13 270 top
U1  L7805CV  [TO-220-3_L10.0-W4.5-P2.54-L]  71.12 158.75 180 top

## Footprints (pads in the part's own frame, mm; a bottom-side part is the same pattern mirrored in y, then rotated)
C0805
  rect 1.41x1.35 smd: 1(-1,0) 2(1,0)
DC-IN-TH_DC-005C-20A
  oval 1.6x3.1 hole 0.8x2.3: 1(3.325,2.35) 2(-3.325,2.35)
  oval 3.1x1.6 hole 2.3x0.8: 3(0.775,-2.35)
DO-41_BD2.4-L4.7-P8.70-D0.9-RD
  round 1.8 hole 1: 1(-4.35,0) 2(4.35,0)
HDR-TH_3P-P2.54-V-M
  rect 1.7x1.7 hole 1.1: 1(-2.54,0)
  round 1.7 hole 1.1: 2(0,0) 3(2.54,0)
HDR-TH_10P-P2.54-V-F
  rect 1.575x1.7 hole 1.1: 1(-11.43,0)
  round 1.7 hole 1.1: 2(-8.89,0) 3(-6.35,0) 4(-3.81,0) 5(-1.27,0) 6(1.27,0) 7(3.81,0) 8(6.35,0) 9(8.89,0) 10(11.43,0)
HDR-TH_10P-P2.54-V-F-R2-C5-S2.54
  rect 1.575x1.7 hole 1.1: 1(-5.08,-1.27)
  round 1.7 hole 1.1: 2(-5.08,1.27) 3(-2.54,-1.27) 4(-2.54,1.27) 5(0,-1.27) 6(0,1.27) 7(2.54,-1.27) 8(2.54,1.27) 9(5.08,-1.27) 10(5.08,1.27)
HDR-TH_14P-P2.54-V-F-R2-C7-S2.54
  round 1.8 hole 1: 1(-7.62,-1.27) 2(-7.62,1.27) 3(-5.08,-1.27) 4(-5.08,1.27) 5(-2.54,-1.27) 6(-2.54,1.27) 7(0,-1.27) 8(0,1.27) 9(2.54,-1.27) 10(2.54,1.27) 11(5.08,-1.27) 12(5.08,1.27) 13(7.62,-1.27) 14(7.62,1.27)
HDR-TH_42P-P2.54-V-F-R2-C21-S2.54-1
  rect 1.6x1.6 hole 1.05: 1(-25.4,-1.27)
  round 1.6 hole 1.05: 2(-25.4,1.27) 3(-22.86,-1.27) 4(-22.86,1.27) 5(-20.32,-1.27) 6(-20.32,1.27) 7(-17.78,-1.27) 8(-17.78,1.27) 9(-15.24,-1.27) 10(-15.24,1.27) 11(-12.7,-1.27) 12(-12.7,1.27) 13(-10.16,-1.27) 14(-10.16,1.27) 15(-7.62,-1.27) 16(-7.62,1.27) 17(-5.08,-1.27) 18(-5.08,1.27) 19(-2.54,-1.27) 20(-2.54,1.27) 21(0,-1.27) 22(0,1.27) 23(2.54,-1.27) 24(2.54,1.27) 25(5.08,-1.27) 26(5.08,1.27) 27(7.62,-1.27) 28(7.62,1.27) 29(10.16,-1.27) 30(10.16,1.27) 31(12.7,-1.27) 32(12.7,1.27) 33(15.24,-1.27) 34(15.24,1.27) 35(17.78,-1.27) 36(17.78,1.27) 37(20.32,-1.27) 38(20.32,1.27) 39(22.86,-1.27) 40(22.86,1.27) 41(25.4,-1.27) 42(25.4,1.27)
LED-TH_BD4.0-P2.54-FD
  round 1.651 hole 0.9: 1(-1.27,0) 2(1.27,0)
Pad_e773
  round 1.152 hole 1.152: 1(0,0)
Pad_e1083
  round 1.152 hole 1.152: 1(0,0)
Pad_e1084
  round 1.152 hole 1.152: 1(0,0)
R0603
  rect 0.806x0.864 smd: 1(-0.753,0) 2(0.753,0)
R0805_1
  rect 1.133x1.377 smd: 1(-0.966,0) 2(0.966,0)
SOIC-14_L8.7-W3.9-P1.27-LS6.0-BL
  oval 0.574x2.038 smd: 1(-3.81,-2.769) 2(-2.54,-2.769) 3(-1.27,-2.769) 4(0,-2.769) 5(1.27,-2.769) 6(2.54,-2.769) 7(3.81,-2.769) 8(3.81,2.769) 9(2.54,2.769) 10(1.27,2.769) 11(0,2.769) 12(-1.27,2.769) 13(-2.54,2.769) 14(-3.81,2.769)
SOIC-16_L9.9-W3.9-P1.27-LS6.0-BL-1
  oval 0.6x1.8 smd: 1(-4.445,-2.972) 2(-3.175,-2.972) 3(-1.905,-2.972) 4(-0.635,-2.972) 5(0.635,-2.972) 6(1.905,-2.972) 7(3.175,-2.972) 8(4.445,-2.972) 9(4.445,2.972) 10(3.175,2.972) 11(1.905,2.972) 12(0.635,2.972) 13(-0.635,2.972) 14(-1.905,2.972) 15(-3.175,2.972) 16(-4.445,2.972)
SOP-14_L8.5-W3.8-P1.27-LS6.2-BL
  oval 0.569x2.203 smd: 1(-3.81,-2.7) 2(-2.54,-2.7) 3(-1.27,-2.7) 4(0,-2.7) 5(1.27,-2.7) 6(2.54,-2.7) 7(3.81,-2.7) 8(3.81,2.7) 9(2.54,2.7) 10(1.27,2.7) 11(0,2.7) 12(-1.27,2.7) 13(-2.54,2.7) 14(-3.81,2.7)
SOP-16_L9.9-W3.9-P1.27-LS6.0-BL
  oval 0.574x2.038 smd: 1(-4.445,-2.769) 2(-3.175,-2.769) 3(-1.905,-2.769) 4(-0.635,-2.769) 5(0.635,-2.769) 6(1.905,-2.769) 7(3.175,-2.769) 8(4.445,-2.769) 9(4.445,2.769) 10(3.175,2.769) 11(1.905,2.769) 12(0.635,2.769) 13(-0.635,2.769) 14(-1.905,2.769) 15(-3.175,2.769) 16(-4.445,2.769)
TO-220-3_L10.0-W4.5-P2.54-L
  rect 1.8x2.6 hole 1.2: 1(-2.54,0.005)
  oval 1.8x2.6 hole 1.2: 2(0,0.005) 3(2.54,-0.005)
TSSOP-14_L5.0-W4.4-P0.65-LS6.4-BL
  rect 0.4x1.7 smd: 1(-1.95,-2.8) 2(-1.3,-2.8) 3(-0.65,-2.8) 4(0,-2.8) 5(0.65,-2.8) 6(1.3,-2.8) 7(1.95,-2.8) 8(1.95,2.8) 9(1.3,2.8) 10(0.65,2.8) 11(0,2.8) 12(-0.65,2.8) 13(-1.3,2.8) 14(-1.95,2.8)
TSSOP-20_L6.5-W4.4-P0.65-LS6.4-BL
  oval 0.364x1.742 smd: 1(-2.925,-2.871) 2(-2.275,-2.871) 3(-1.625,-2.871) 4(-0.975,-2.871) 5(-0.325,-2.871) 6(0.325,-2.871) 7(0.975,-2.871) 8(1.625,-2.871) 9(2.275,-2.871) 10(2.925,-2.871) 11(2.925,2.871) 12(2.275,2.871) 13(1.625,2.871) 14(0.975,2.871) 15(0.325,2.871) 16(-0.325,2.871) 17(-0.975,2.871) 18(-1.625,2.871) 19(-2.275,2.871) 20(-2.925,2.871)
TSSOP-24_L7.8-W4.4-P0.65-LS6.4-BL_1
  oval 0.364x1.71 smd: 1(-3.575,-2.78) 2(-2.925,-2.78) 3(-2.275,-2.78) 4(-1.625,-2.78) 5(-0.975,-2.78) 6(-0.325,-2.78) 7(0.325,-2.78) 8(0.975,-2.78) 9(1.625,-2.78) 10(2.275,-2.78) 11(2.925,-2.78) 12(3.575,-2.78) 13(3.575,2.78) 14(2.925,2.78) 15(2.275,2.78) 16(1.625,2.78) 17(0.975,2.78) 18(0.325,2.78) 19(-0.325,2.78) 20(-0.975,2.78) 21(-1.625,2.78) 22(-2.275,2.78) 23(-2.925,2.78) 24(-3.575,2.78)

## Nets
As in the schematic.

Pads without a net: bw_U1 9 10 11 13 14 15 16 17; cd_AND1 4 5 6 8 9 10 11 12 13; cd_NOT1 5 6 10 11 12 13; cd_OR2 8 9 10; dc_BadA 11 12 13 14; dc_BadB 11 12 13 14; dc_BadOUT 6 7 8 9 11 12 13 14; dc_BadPCINC 6 7 8 9 11 12 13 14; dc_BOP1 7 8 9 11 12 13; dc_D1 9 12; dc_DOP 7 8 9 12 13 14; dc_U1 5 6 8 9 10 11 12 13; NOREF 1; NOREF#2 1; NOREF#3 1; op_DC0 4 5 6 8 10 11 13 16 17; op_DC1 2 3 4 7 8 13; op_U2 4 5 6 8 9 10 11 12 13; op_U3 5 6 8 9 10 11 12 13; op_U4 11 12 13; pc_U4 9; pc_U5 8 9 10 11 12 13; pc_U6 8 9 10 11 12 13; pg_U1 3 4 5 6 8 9 10 11 12 13; rg_DCA 11 14 15 16 17; rg_DCB 11 14 15 16 17; rg_DCC 9 10 11 13 14 15 16 17; rg_DCSET 10 11 14 15 16 17

## Via types
v1: diameter 0.5, hole 0.3, Top Layer to Bottom Layer, 1475 vias
v2: diameter 0.7, hole 0.35, Top Layer to Bottom Layer, 38 vias

## Routing (per net, layer and track width the routed paths; a pad name or vN(x,y) marks a point on that pad's centre or on a via; arc(x,y) is an arc through that point)
+5V: length 2605
  Top Layer w0.254: 67.06,114.3 67.06,113.54 66.55,113.03 ; 67.06,114.3 66.55,114.81 C57.2 63.25,114.82 63.25,115.82 62.74,116.33 54.61,116.33 ; 67.06,114.3 67.56,114.81 69.6,114.81 70.1,114.3 ; 25.39,147.71 26.67,146.44 28.88,146.44 ; 25.39,147.71 25.76,148.08 28.45,148.08 29.72,149.35 32.5,149.35 32.75,149.1 C31.2 ; 25.39,147.71 25.02,148.08 C30.2 ; 25.39,96.91 25.76,97.28 28.45,97.28 29.72,98.55 32.5,98.55 32.75,98.3 C11.2 ; 25.39,96.91 26.67,95.63 28.88,95.63 ; 25.39,96.91 25.02,97.28 C10.2 ; lg_BOUT1.20 99.94,86.36 99.68,86.09 C98.2 96.52,86.09 95.76,85.33 v2(95.76,83.82) 95.76,82.22 ; 21.92,146.44 20.57,146.44 20.02,146.99 20.02,148.08 C30.2 ; C14.2 20.05,108.46 19.8,108.71 17.02,108.71 15.75,107.44 C13.2 11.16,106.32 11.68,105.79 rg_BA3.1 ; C14.2 25.02,107.44 25.39,107.07 ; C14.2 20.02,107.44 20.02,106.35 20.57,105.79 rg_BA3.20 ; dc_BadOUT.1 78.49,61.84 79.01,61.32 C72.2 74.42,60.2 73.15,58.93 70.37,58.93 70.12,59.18 C77.2 66.42,60.2 66.05,60.57 ; db_B3.2 142.24,15.5 ; 142.24,15.5 142.24,14.85 ; 142.24,15.5 142.24,20.32 143.24,21.32 C110.2 143.24,27.18 ; C27.2 32.72,137.92 32.72,136.83 33.27,136.27 rg_BB6.20 ; C27.2 32.75,138.94 32.5,139.19 29.72,139.19 28.45,137.92 25.76,137.92 25.39,137.55 ; C27.2 37.72,137.92 38.09,137.55 ; 38.09,137.55 39.37,136.27 rg_BC6.1 ; 38.09,137.55 38.46,137.92 41.15,137.92 42.42,139.19 45.2,139.19 45.45,138.94 C28.2 ; 133.08,155.59 132.08,154.59 ; 133.08,155.59 133.35,155.32 134.95,155.32 ; 133.08,155.59 C89.2 133.08,158 132.33,158.75 124.46,158.75 ; 132.08,154.59 131.35,155.32 129.21,155.32 ; 132.08,154.59 132.08,149.86 133.08,148.86 C88.2 133.08,145.44 133.35,145.16 io_BOUT1.20 ; 69.09,93.98 68.58,94.49 v2(68.58,96.01) 68.58,98.3 66.55,100.33 ; 69.09,93.98 cd_AND1.14 ; 69.09,93.98 68.58,93.47 68.58,92.71 69.09,92.2 C60.2 ; 25.52,117.37 25.76,117.6 28.45,117.6 29.72,118.87 32.5,118.87 32.75,118.62 C19.2 ; 25.52,117.37 26.94,115.95 29.15,115.95 ; 25.52,117.37 25.29,117.6 20.28,117.6 20.28,116.51 20.84,115.95 22.19,115.95 ; 86.36,110.49 85.09,109.22 85.09,102.87 83.82,101.6 80.01,101.6 ; 86.36,110.49 op_U2.14 ; 86.36,110.49 86.09,110.76 C85.2 86.09,114.3 87.11,115.32 C82.1 89.17,116.8 ; pc_BB1.20 62.48,9.27 61.93,9.83 61.93,10.92 C44.2 61.96,11.94 61.71,12.19 58.93,12.19 57.66,10.92 54.97,10.92 54.6,10.55 ; pc_U5.14 8.3,21.59 8.57,21.86 C53.2 11.92,21.86 ; 16.18,126.11 11.68,126.11 11.16,126.64 C21.2 15.75,127.76 17.02,129.03 19.8,129.03 20.05,128.78 C22.2 ; C26.2 20.05,138.94 19.8,139.19 17.02,139.19 15.75,137.92 C25.2 11.16,136.8 11.68,136.27 rg_BA6.1 ; C26.2 20.02,137.92 20.02,136.83 20.57,136.27 rg_BA6.20 ; C26.2 25.02,137.92 25.39,137.55 ; C7.2 37.72,87.12 38.09,86.75 ; C7.2 32.75,88.14 32.5,88.39 29.72,88.39 28.45,87.12 25.76,87.12 25.39,86.75 ; C7.2 32.72,87.12 32.72,86.03 33.27,85.47 rg_BB1.20 ; rg_BA1.20 20.57,85.47 20.02,86.03 20.02,87.12 C6.2 ; pc_BOUT0.20 21.84,29.59 21.32,30.12 C51.2 ; 25.39,127.39 26.67,126.11 28.88,126.11 ; 25.39,127.39 25.02,127.76 C22.2 ; 25.39,127.39 25.76,127.76 28.45,127.76 29.72,129.03 32.5,129.03 32.75,128.78 C23.2 ; 92.06,97.52 92.33,97.79 92.33,99.39 ; 92.06,97.52 C95.2 ; 92.06,97.52 92.33,97.25 92.33,96.52 98.55,96.52 ; 66.05,70.73 65.68,70.36 62.99,70.36 61.72,69.09 58.94,69.09 58.69,69.34 C67.2 ; 66.05,70.73 64.77,72 62.56,72 ; 66.05,70.73 66.42,70.36 C68.2 70.12,69.34 70.37,69.09 73.15,69.09 74.42,70.36 C66.2 79.01,71.48 78.49,72 73.99,72 ; C95.2 90.66,97.54 89.66,97.54 89.15,97.03 89.15,92.46 90.17,91.44 91.82,91.44 92.33,91.95 st_BOUT1.1 ; C95.2 90.68,100.33 91.44,101.09 96.55,101.09 ; 54.6,10.55 54.23,10.92 C43.2 ; 54.6,10.55 55.88,9.27 pc_BB1.1 ; 66.55,102.11 67.06,101.6 67.06,100.84 66.55,100.33 ; 66.55,102.11 C58.2 ; 66.55,102.11 67.06,102.62 67.06,112.52 66.55,113.03 ; dc_BB.20 58.17,82.16 58.72,81.61 58.72,80.52 C70.2 ; 38.09,76.59 38.46,76.96 41.15,76.96 42.42,78.23 45.2,78.23 45.45,77.98 C4.2 ; 38.09,76.59 37.72,76.96 C3.2 ; 38.09,76.59 39.37,75.31 rg_BC0.1 ; C109.2 95.25,19.81 ; C109.2 82.28,18.3 82.55,18.03 db_B2.20 ; C109.2 82.28,21.1 81.79,21.59 77.47,21.59 76.2,20.32 76.2,19.05 77.22,18.03 db_B2.1 ; 95.25,19.81 95.25,20.32 96.52,21.59 ; 95.25,19.81 95.25,19.05 96.27,18.03 db_B1.1 ; 98.55,96.52 99.31,95.76 99.31,92.46 100.33,91.44 101.98,91.44 102.49,91.95 st_BOUT2.1 ; 98.55,96.52 99.55,97.52 C94.2 102.22,97.52 102.49,97.79 102.49,99.39 ; 66.55,113.03 cd_OR1.14 ; C78.2 54.61,60.2 ; C78.2 58.69,59.18 58.94,58.93 61.72,58.93 62.99,60.2 65.68,60.2 66.05,60.57 ; C78.2 58.72,60.2 58.72,61.29 58.17,61.84 dc_BadPCINC.20 ; 21.92,95.63 20.57,95.63 20.02,96.19 20.02,97.28 C10.2 ; 66.05,80.89 64.77,82.16 dc_BB.1 ; 66.05,80.89 66.42,80.52 C71.2 70.12,79.5 70.37,79.25 73.15,79.25 74.42,80.52 C69.2 79.01,81.64 78.49,82.16 dc_BadB.1 ; 66.05,80.89 65.68,80.52 62.99,80.52 61.72,79.25 58.94,79.25 58.69,79.5 C70.2 ; 38.22,117.37 37.99,117.6 32.98,117.6 32.98,116.51 33.54,115.95 34.89,115.95 ; 38.22,117.37 39.64,115.95 41.84,115.95 ; 38.22,117.37 38.46,117.6 41.15,117.6 42.42,118.87 45.2,118.87 45.45,118.62 C20.2 ; C65.2 46.72,156.14 47.24,155.62 pg_U1.14 ; C65.2 46.72,158.51 46.23,159 43.69,159 42.93,158.24 C64.2 ; C65.2 53.85,157.48 54.61,156.72 ; 96.52,21.59 100.84,21.59 101.33,21.1 C108.2 101.33,18.3 101.6,18.03 db_B1.20 ; 96.52,21.59 96.52,22.86 ; 47.32,95.63 45.97,95.63 45.42,96.19 45.42,97.28 C12.2 ; C36.1 21.32,56.17 21.84,55.64 rg_DCSET.24 ; C36.1 22.1,57.15 22.62,57.68 rg_DCA.24 22.62,62.23 ; C36.1 21.02,57.15 ; 64.77,61.84 dc_BadPCINC.1 ; 64.77,61.84 64.77,63.94 64.26,64.44 dc_BadPCINC.5 ; 64.77,61.84 66.05,60.57 ; 20.05,117.6 20.05,118.62 19.8,118.87 17.02,118.87 15.75,117.6 C17.2 11.16,116.48 11.68,115.95 rg_BA4.1 ; C30.2 20.05,149.1 19.8,149.35 17.02,149.35 15.75,148.08 C29.2 11.16,146.96 11.68,146.44 16.18,146.44 ; lg_BOUT2.1 141.73,56.21 142.24,55.7 142.24,52.83 141.75,52.34 C97.2 ; C51.2 25.91,31.24 27.18,32.51 29.96,32.51 30.21,32.26 C49.2 34.29,31.24 ; C51.2 21.32,32.26 21.07,32.51 18.03,32.51 17.45,31.93 17.45,29.59 16.12,29.59 15.75,29.97 11.68,29.97 10.92,29.21 10.92,25.4 11.92,24.4 11.92,21.86 ; v2(123.44,78.74) 124.46,78.74 ; C103.2 129.27,119.13 127.76,119.13 127,118.36 ; C103.2 129.29,128.52 130.05,129.29 131.3,129.29 C96.2 132.69,129.27 ; C103.2 131.18,119.11 131.44,119.38 131.44,121.08 ; 100.94,115.3 C93.2 98.3,115.3 96.55,113.55 v2(96.55,113.02) 96.55,101.09 ; 100.94,115.3 101.22,115.03 bw_BOUT.1 ; 100.94,115.3 101.22,115.57 101.22,117.17 ; rg_BC1.20 45.97,85.47 45.42,86.03 45.42,87.12 C8.2 ; 56.82,72 58.17,72 58.72,71.45 58.72,70.36 C67.2 ; v1(63.5,14.6) 64.01,14.6 64.52,15.11 64.52,17.53 64.13,17.91 62.63,17.91 C45.2 62.23,20.57 61.85,20.95 v2(61.21,20.95) 51.94,20.95 51.31,21.59 50.55,21.59 49.53,20.57 ; 38.09,96.91 38.46,97.28 41.15,97.28 42.42,98.55 45.2,98.55 45.45,98.3 C12.2 ; 38.09,96.91 37.72,97.28 C11.2 ; 38.09,96.91 39.37,95.63 41.58,95.63 ; 10.16,57.15 10.84,57.83 rg_U1.14 ; 10.16,57.15 v2(10.67,56.64) ; 10.16,57.15 5.33,57.15 4.83,57.66 4.83,61.53 ; 58.09,126.92 54.61,126.92 ; 58.09,126.92 dc_BOP1.1 ; 58.09,126.92 58.93,127.76 61.71,127.76 61.96,127.51 C73.2 ; 11.92,21.86 12.45,21.34 12.45,8.38 ; 142.24,14.85 145.11,14.85 ; 142.24,14.85 139.37,14.85 ; pc_D2.20 33.66,29.59 34.29,30.23 34.29,31.24 ; rg_BC6.20 45.97,136.27 45.42,136.83 45.42,137.92 C28.2 ; C81.1 89.17,125.73 90.42,124.48 90.42,118.06 89.17,116.8 ; C81.1 89.17,128.23 88.9,128.5 op_DC0.24 ; C81.1 86.11,126.75 85.09,127.76 C83.2 81,127.75 81,125.91 81.18,125.73 op_U1.14 ; C64.2 32.72,158.24 32.72,157.15 33.27,156.59 pg_BB0.20 ; C64.2 32.75,159.26 32.5,159.51 29.72,159.51 28.45,158.24 25.76,158.24 25.39,157.87 ; C73.2 61.96,125.37 62.48,124.84 dc_BOP1.20 ; C73.2 66.55,126.49 67.82,127.76 70.6,127.76 70.85,127.51 ; C32.2 45.42,148.08 45.42,146.99 45.97,146.44 47.32,146.44 ; C32.2 54.61,148.08 ; C32.2 45.45,149.1 45.2,149.35 42.42,149.35 41.15,148.08 38.46,148.08 38.09,147.71 ; 41.58,146.44 39.37,146.44 38.09,147.71 ; 108.34,133.35 102.62,133.35 101.62,132.35 C75.2 100.58,131.57 v2(99.06,130.05) 98.04,129.03 C90.2 100.06,125.46 100.33,125.73 op_U4.14 ; 108.34,133.35 mu_BOUT.1 ; 108.34,133.35 mu_BOUT.20 ; 89.17,116.8 88.9,117.07 op_DC1.24 ; 66.55,100.33 cd_OR2.14 ; 97.79,78.97 97.79,77.47 97.52,77.2 C99.2 ; 132.08,96.17 131.35,96.9 io_BA0.1 ; 132.08,96.17 133.08,97.17 ; 132.08,96.17 132.08,91.44 133.08,90.44 C86.2 133.08,87.01 133.35,86.74 io_BOUT0.20 ; 132.69,129.27 132.97,129.54 132.97,131.14 ; 132.69,129.27 132.97,129 ar_BOUT.1 ; 22.62,62.23 22.37,62.48 v2(21.08,62.48) ; 22.62,62.23 22.9,62.5 C33.1 26.37,62.5 26.67,62.8 34.76,62.8 35.33,62.23 ; C70.2 54.61,80.52 ; rg_BA1.1 11.68,85.47 11.16,86 C5.2 15.75,87.12 17.02,88.39 19.8,88.39 20.05,88.14 C6.2 ; C31.2 37.72,148.08 38.09,147.71 ; C31.2 32.72,148.08 32.72,146.99 33.27,146.44 34.62,146.44 ; 133.08,97.17 C87.2 133.08,99.58 132.33,100.33 124.46,100.33 ; 133.08,97.17 133.35,96.9 io_BA0.20 ; C10.2 20.05,98.3 19.8,98.55 17.02,98.55 15.75,97.28 C9.2 11.16,96.16 11.68,95.63 16.18,95.63 ; C52.2 25.91,10.92 27.18,12.19 29.96,12.19 30.21,11.94 C50.2 ; C52.2 21.32,9.8 21.84,9.27 pc_BOUT1.20 ; C52.2 21.32,11.94 21.07,12.19 ; 96.55,101.09 107.44,101.09 108.2,101.85 C101.1 106.72,104.41 106.44,104.14 bw_U1.24 ; C6.2 25.02,87.12 25.39,86.75 ; C3.2 32.75,77.98 32.5,78.23 29.72,78.23 28.45,76.96 25.76,76.96 25.39,76.59 ; C3.2 32.72,76.96 32.72,75.87 33.27,75.31 rg_BB0.20 ; 98.3,29.21 89.92,29.21 89.41,29.72 89.41,33.27 88.9,33.78 C91.2 ; 98.3,29.21 102.24,25.27 ; 98.3,29.21 98.81,29.72 98.81,37.08 98.3,37.59 C92.2 94.98,36.21 95.25,35.94 ld_BOUT.20 ; lg_BOUT1.1 95.76,82.22 ; 95.76,82.22 C99.2 ; pc_D3.20 30.73,9.27 30.21,9.8 C50.2 ; 17.45,11.61 16.18,11.61 14.99,10.41 14.99,9.65 13.72,8.38 12.45,8.38 ; 17.45,11.61 18.03,12.19 21.07,12.19 ; 17.45,11.61 17.45,9.27 ; 127,118.36 127,114.3 129.29,112.01 C102.2 131.18,108.95 131.44,109.22 131.44,110.92 ; 127,118.36 124.46,118.36 ; 36.83,20.57 C47.2 ; 36.83,20.57 36.45,20.95 v2(35.81,20.95) 24.51,20.95 24.13,20.57 ; 36.83,20.57 37.85,21.59 43.69,21.59 44.32,20.95 v2(48.51,20.95) 49.15,20.95 49.53,20.57 ; 25.39,107.07 25.76,107.44 28.45,107.44 29.72,108.71 32.5,108.71 32.75,108.46 32.75,107.44 ; 25.39,107.07 26.67,105.79 rg_BB3.1 ; 25.39,157.87 25.02,158.24 C63.2 ; 25.39,157.87 26.67,156.59 pg_BB0.1 ; 70.15,70.36 70.15,71.45 69.6,72 68.25,72 ; C39.2 44.96,31.24 46.23,32.51 49.01,32.51 49.26,32.26 C40.2 ; C39.2 40.37,32.26 40.12,32.51 37.34,32.51 36.07,31.24 34.29,31.24 ; C39.2 40.37,30.12 40.89,29.59 pc_D0.20 pc_BA0.1 ; C24.2 45.45,128.78 45.2,129.03 42.42,129.03 41.15,127.76 38.46,127.76 38.09,127.39 ; C24.2 54.61,127.76 ; C24.2 45.42,127.76 45.42,126.67 45.97,126.11 47.32,126.11 ; C43.2 49.26,11.94 49.01,12.19 46.23,12.19 44.96,10.92 C42.2 ; C43.2 49.23,10.92 49.23,9.83 49.78,9.27 pc_BA1.20 ; C99.2 94.73,77.2 93.98,76.45 93.98,72.9 95.76,71.12 C100.2 97.52,68.31 97.79,68.58 lg_U2.14 ; C20.2 54.61,117.6 ; C20.2 45.42,117.6 45.42,116.51 45.97,115.95 rg_BC4.20 ; rg_BB1.1 26.67,85.47 25.39,86.75 ; C8.2 54.61,87.12 ; C8.2 45.45,88.14 45.2,88.39 42.42,88.39 41.15,87.12 38.46,87.12 38.09,86.75 ; 24.13,20.57 C48.2 ; 24.13,20.57 23.75,20.95 v2(23.11,20.95) 21.72,20.95 21.34,20.57 21.34,12.46 21.07,12.19 ; pc_BA1.1 pc_D1.20 40.89,9.27 40.37,9.8 C42.2 ; C63.2 20.05,159.26 19.8,159.51 17.02,159.51 15.75,158.24 11.16,158.24 11.16,157.12 11.68,156.59 pg_BA0.1 ; C63.2 20.02,158.24 20.02,157.15 20.57,156.59 pg_BA0.20 ; lg_U3.14 132.08,72.39 131.81,72.12 C104.2 128.76,72.12 128.27,71.63 128.27,63.23 ; rg_BB3.20 33.27,105.79 32.72,106.35 32.72,107.44 32.75,107.44 ; H3.1 91.44,22.86 75.95,22.86 75.18,23.62 75.18,24.62 C80.2 75.2,26.01 74.93,26.28 ; C91.2 86.09,35.42 86.61,35.94 ld_BOUT.1 ; C91.2 86.09,32.4 86.36,32.13 ld_BOUT2.20 ; hd_DOUT2.20 74.93,26.28 ; 74.93,26.28 76.2,27.55 76.2,32.51 75.2,33.51 C79.2 75.2,36.17 74.93,36.44 hd_DOUT.20 ; rg_U2.14 10.84,46.65 10.41,46.23 10.2,46.23 ; rg_BA0.20 20.57,75.31 20.02,75.87 20.02,76.96 C2.2 ; 38.09,107.07 38.46,107.44 41.15,107.44 42.42,108.71 45.2,108.71 45.45,108.46 C16.2 ; 38.09,107.07 37.72,107.44 32.75,107.44 ; 38.09,107.07 39.37,105.79 rg_BC3.1 ; dc_BadOUT.20 69.6,61.84 70.15,61.29 70.15,60.2 ; 128.27,63.23 128.27,49.53 129.54,48.26 139.7,48.26 140.46,49.02 C97.2 ; 128.27,63.23 C105.2 131.81,63.23 132.08,63.5 lg_U4.14 ; 128.27,63.23 124.46,63.23 ; C11.2 32.72,97.28 32.72,96.19 33.27,95.63 34.62,95.63 ; C2.2 25.02,76.96 25.39,76.59 ; C2.2 20.05,77.98 19.8,78.23 17.02,78.23 15.75,76.96 C1.2 11.16,75.84 11.68,75.31 rg_BA0.1 ; 25.39,137.55 26.67,136.27 rg_BB6.1 ; rg_DCB.24 35.33,62.23 ; 35.33,62.23 35.59,62.5 C34.1 41.86,62.5 42.16,62.8 47.45,62.8 48.03,62.23 ; 80.01,101.6 C76.2 81.28,97.52 81.87,98.11 dc_U1.14 ; 80.01,101.6 80.01,103.89 77.22,106.68 77.22,114.3 76.71,114.81 70.61,114.81 70.1,114.3 ; 70.1,114.3 C59.2 70.13,113.04 cd_NOT1.14 ; dc_DOP.20 71.37,124.84 70.82,125.4 70.82,126.49 ; C12.2 54.61,97.28 ; C4.2 54.61,76.96 ; C4.2 45.42,76.96 45.42,75.87 45.97,75.31 rg_BC0.20 ; 10.2,46.23 10.19,46.24 rg_U2.13 ; 10.2,46.23 10.2,43.94 ; 10.2,46.23 5.59,46.23 5.08,46.74 5.08,50.1 ; C22.2 20.02,127.76 20.02,126.67 20.57,126.11 21.92,126.11 ; 34.62,126.11 33.27,126.11 32.72,126.67 32.72,127.76 C23.2 ; dc_BadB.20 69.6,82.16 70.15,81.61 70.15,80.52 ; rg_BC3.20 45.97,105.79 45.42,106.35 45.42,107.44 C16.2 ; 12.45,8.38 8.13,4.06 5.84,4.06 5.35,4.56 C56.2 5.35,7.1 4.83,7.62 pc_U6.14 ; rg_BC1.1 39.37,85.47 38.09,86.75 ; 70.85,127.51 C74.2 ; 70.85,127.51 76.2,132.86 76.2,136.4 76.69,136.89 C84.2 79.06,136.89 79.33,137.16 op_U3.14 ; 54.6,30.87 55.88,29.59 pc_BB0.1 ; 54.6,30.87 54.23,31.24 C40.2 ; 54.6,30.87 54.97,31.24 57.66,31.24 58.93,32.51 61.71,32.51 61.96,32.26 C41.2 61.93,31.24 61.93,30.15 62.48,29.59 pc_BB0.20 ; 49.53,20.57 C46.2 ; C42.2 40.37,11.94 40.12,12.19 37.34,12.19 36.07,10.92 C50.2 ; C67.2 54.61,70.36 ; 48.03,62.23 48.3,62.5 C35.1 54.61,62.5 ; 48.03,62.23 rg_DCC.24 ; v2(123.44,113.03) 124.46,113.03 ; C40.2 49.23,31.24 49.23,30.15 49.78,29.59 pc_BA0.20 ; 38.09,127.39 37.72,127.76 C23.2 ; 38.09,127.39 39.37,126.11 41.58,126.11 ; C28.2 54.61,137.92 ; C97.2 139.09,52.34 138.81,52.07 lg_BOUT2.20 ; v2(123.44,132.08) 124.46,132.08 ; C16.2 54.61,107.44 ; rg_BB0.1 26.67,75.31 25.39,76.59
  Top Layer w0.508: 104.14,27.18 99.82,22.86 91.44,22.86 ; 104.14,27.18 145.03,27.18 146.3,28.45 146.3,155.96 142.24,160.02 124.46,160.02 124.46,137.16 ; 104.14,27.18 db_HRES.1 db_HB.1 db_HA.1 ; io_H0.1 142.24,80.01 140.97,78.74 124.46,78.74 ; C106.2 67.58,156.21 68.58,157.21 U1.3 ; 124.46,78.74 124.46,43.18 125.73,41.91 H4.1 ; 124.46,78.74 124.46,137.16 ; 54.61,60.2 54.61,54.86 53.09,53.34 38.1,53.34 32.77,48.01 25.65,48.01 21.59,43.94 4.32,43.94 2.29,41.91 2.29,38.35 4.32,36.32 9.91,36.32 11.68,34.54 11.68,29.97 ; 124.46,137.16 140.97,137.16 142.24,138.43 io_H1.1
  Top Layer w0.762: 54.61,60.2 54.61,156.72 56.65,158.75 64.77,158.75 ; U1.3 64.77,158.75 ; 64.77,158.75 64.77,151.64 66.04,150.37 79.25,150.37 88.9,160.02 93.98,160.02 96.52,157.48 101.6,157.48 104.14,160.02 124.46,160.02
  Bottom Layer w0.254: pc_U4.16 v2(23.11,20.95) ; 68.56,98.06 69.13,98.64 69.13,99.4 68.56,99.97 67.37,99.97 ; 68.56,98.06 68.58,98.04 v2(68.58,96.01) 68.58,95 68.07,94.49 57.4,94.49 56.9,95 56.9,102.51 58.17,103.78 61.62,103.78 ; 68.56,98.06 C61.2 ; v2(21.08,62.48) 21.08,60.96 16.76,56.64 v2(10.67,56.64) ; pc_U3.16 v2(35.81,20.95) ; v2(99.06,130.05) 107.7,130.05 109.73,132.08 v2(123.44,132.08) ; pc_U2.16 v2(48.51,20.95) ; v2(96.55,113.02) 123.44,113.02 v2(123.44,113.03) ; pc_U1.6 v1(63.5,14.6) ; v2(123.44,78.74) 122.43,78.74 118.62,82.55 99.06,82.55 97.79,83.82 v2(95.76,83.82) ; pc_U1.16 v2(61.21,20.95)
GND: length 3243.6
  Top Layer w0.254: C50.1 28.21,10.14 29.21,9.14 29.21,4.06 28.58,3.42 ; v2(145.29,25.91) 145.29,22.61 145.11,22.43 db_B3.10 ; 8.89,95.63 7.29,95.63 ; 8.89,95.63 9.16,95.9 C9.1 ; 8.89,95.63 9.07,95.46 9.07,89.96 8.89,89.78 ; v1(22.86,19.68) 22.86,15.75 23.11,15.49 ; 59.69,87.76 58.55,88.9 v2(55.88,88.9) ; 59.69,87.76 59.69,82.8 60.64,81.85 60.64,80.77 60.39,80.52 ; 59.69,87.76 59.94,88.01 dc_BB.10 63.63,88.01 64.77,89.15 69.6,89.15 70.87,87.88 70.87,87.76 ; 38.1,29.59 pc_D0.1 ; 38.1,29.59 38.37,29.86 C39.1 ; 38.1,29.59 38.28,29.42 38.28,23.92 38.1,23.74 ; 80.28,17.38 C109.1 ; 80.28,17.38 80.28,15.24 ; 80.28,17.38 db_B2.19 ; 8.89,150.74 10.03,149.61 13.72,149.61 14.86,150.74 19.05,150.74 19.3,151 ; 8.89,150.74 7.29,150.74 ; 8.89,150.74 9.07,150.92 9.07,156.42 8.89,156.59 ; 15.48,66.28 15.48,64.77 16.75,63.5 ; C23.1 30.75,126.73 32,125.48 32,120.52 ; 127,88.39 v2(125.73,88.39) ; 127,88.39 C86.1 131.08,87.01 130.81,86.74 io_BOUT0.1 ; 127,88.39 127,91.05 ; 127,88.39 127,81.53 127.64,80.89 io_BOUT0.10 ; 28.58,3.42 29.72,2.29 34.04,2.29 35.17,3.42 pc_D1.10 38.1,3.42 ; 28.58,3.42 pc_D3.10 25.27,3.42 24.13,2.29 20.07,2.29 18.93,3.42 ; v2(53.34,129.03) 46.35,129.03 44.7,130.68 ; 75.34,118.11 op_U1.7 ; 75.34,118.11 74.83,118.62 74.83,127.25 75.34,127.76 C83.1 79.01,129.27 77.47,130.81 C84.1 82.96,134.89 83.23,134.62 ; 75.34,118.11 75.44,118.01 75.44,117.09 ; 8.89,89.78 10.03,88.65 13.72,88.65 14.86,89.78 rg_BA2.10 19.05,89.78 19.3,90.04 ; 8.89,89.78 rg_D2.10 ; 77.47,32.13 77.29,31.96 77.29,26.46 77.47,26.28 ; 77.47,32.13 hd_DOUT2.10 ld_BOUT2.1 83.82,32.13 84.09,32.4 C91.1 84.09,37.1 84.58,37.59 C92.1 92.98,36.56 93.98,35.56 93.98,30.48 93.59,30.09 91.11,30.09 ; 77.47,32.13 77.2,32.4 C79.1 77.2,36.17 77.47,36.44 ; C26.1 18.05,136.89 19.3,135.64 19.3,130.68 ; 8.89,79.62 9.07,79.8 9.07,85.3 8.89,85.47 ; 8.89,79.62 rg_D1.10 ; 8.89,79.62 10.03,78.49 13.72,78.49 14.86,79.62 rg_BA1.10 19.05,79.62 19.3,79.88 ; 38.1,9.27 pc_D1.1 ; 38.1,9.27 38.37,9.54 C42.1 ; 38.1,9.27 38.28,9.1 38.28,3.6 38.1,3.42 ; 32,130.68 32,135.64 30.75,136.89 C27.1 ; 32,130.68 31.75,130.42 27.81,130.42 26.67,129.29 20.7,129.29 19.3,130.68 ; 32,130.68 33.4,129.29 39.37,129.29 40.51,130.42 44.45,130.42 44.7,130.68 ; 19.3,151 19.3,155.96 18.05,157.21 C63.1 ; 19.3,151 20.7,149.61 26.67,149.61 27.81,150.74 31.75,150.74 32,151 ; C11.1 30.75,96.25 32,95 32,90.04 ; 70.87,77.6 70.87,72.64 71.82,71.69 71.82,70.36 ; 70.87,77.6 71.12,77.85 dc_BadA.10 75.31,77.85 76.45,78.99 80.14,78.99 81.28,77.85 ; 70.87,77.6 70.87,77.72 69.6,78.99 64.77,78.99 63.63,77.85 dc_BA.10 59.94,77.85 59.69,77.6 ; C32.1 43.45,147.05 44.7,145.8 44.7,140.84 ; 44.72,152.24 C65.1 ; 44.72,152.24 44.2,151.72 pg_U1.7 41.74,151.72 41.4,151.38 41.4,150.11 40.89,149.61 33.4,149.61 32,151 ; 44.72,152.24 46.34,150.62 50.8,150.62 51.31,151.13 v2(53.34,151.13) ; 61.21,3.68 62.61,2.29 69.09,2.29 69.6,2.79 69.6,13.71 ; 61.21,3.68 60.96,3.42 pc_BB1.10 57.02,3.42 55.88,2.29 49.91,2.29 48.51,3.68 ; 61.21,3.68 61.21,8.64 59.96,9.89 C44.1 ; st_BOUT2.9 107.69,95.52 ; 107.69,95.52 108.06,95.52 108.34,95.25 st_BOUT2.10 ; 107.69,95.52 C94.1 100.84,93.47 101.09,93.22 v2(101.09,92.46) ; 19.3,90.04 19.3,95 18.05,96.25 C10.1 ; 19.3,90.04 20.7,88.65 26.67,88.65 27.81,89.78 rg_BB2.10 31.75,89.78 32,90.04 ; v2(55.88,78.74) 58.55,78.74 59.69,77.6 ; 57.33,102.11 56.82,101.6 56.82,93.22 57.33,92.71 59.38,92.71 ; 57.33,102.11 61.15,102.11 ; 57.33,102.11 56.9,102.54 56.9,104.9 57.4,105.41 ; 8.89,105.79 9.16,106.06 C13.1 ; 8.89,105.79 9.07,105.62 9.07,100.12 8.89,99.94 ; 8.89,105.79 rg_D3.1 ; dc_DB.1 81.28,82.16 ; 81.28,82.16 81.1,82.34 81.1,87.84 81.28,88.01 ; 81.28,82.16 80.71,81.59 80.71,80.52 ; io_BA1.10 127,149.47 ; 127,149.47 127,146.81 ; 127,149.47 127,155.7 128.27,156.97 C89.1 ; 3.56,18.54 3.56,21.84 4.83,23.11 ; 3.56,18.54 2.03,17.02 2.03,5.84 5.33,2.54 15.24,2.54 16.12,3.42 18.93,3.42 ; 3.56,18.54 6.86,15.24 ; 8.89,115.95 rg_D4.1 ; 8.89,115.95 9.07,115.78 9.07,110.28 8.89,110.1 ; 8.89,115.95 9.16,116.22 C17.1 ; 20.76,51.74 24.57,51.74 25.4,52.58 25.4,57.15 26.16,57.91 30.99,57.91 31.42,58.35 ; 20.76,51.74 20.32,51.31 20.32,49.53 19.28,48.49 rg_DCSET.12 ; 20.76,51.74 19.32,53.18 C36.2 19.32,58.17 18.73,58.76 rg_DCA.18 18.73,61.79 18.29,62.23 17.27,62.23 16.76,62.74 16.76,63.48 16.75,63.5 ; 4.4,23.54 3.89,23.54 3.3,24.13 v2(3.3,29.72) ; 4.4,23.54 4.83,23.11 ; 4.4,23.54 pc_U5.7 ; 69.6,13.71 69.6,22.1 69.09,22.61 62.61,22.61 61.21,24 ; 69.6,13.71 69.59,13.72 62.99,13.72 62.23,14.48 C45.1 60.96,15.51 ; 77.47,26.28 77.2,26.01 C80.1 88.9,24.64 89.66,25.4 89.66,26.92 90.42,27.69 95.76,27.69 96.52,26.92 H3.3 ; 77.47,26.28 hd_DOUT2.1 ld_BOUT2.10 ; 19.3,69.72 19.05,69.46 rg_BA0.10 14.86,69.46 13.72,68.33 10.03,68.33 8.89,69.46 ; 19.3,69.72 19.3,74.68 18.05,75.93 C2.1 ; 19.3,69.72 20.7,68.33 26.67,68.33 27.81,69.46 rg_BB0.10 31.75,69.46 32,69.72 ; 139.7,61.72 139.19,62.23 131.83,62.23 130.83,61.23 C105.1 130.05,54.86 130.81,54.1 132.97,54.1 ; 139.7,61.72 lg_U4.7 ; 139.7,61.72 140.97,62.99 140.97,65.79 139.7,67.06 lg_U3.7 139.7,70.61 139.19,71.12 131.83,71.12 130.83,70.12 C104.1 ; 32,100.2 31.75,99.94 rg_BB3.10 27.81,99.94 26.67,98.81 20.7,98.81 19.3,100.2 ; 32,100.2 32,105.16 30.77,106.39 C15.1 ; 32,100.2 33.4,98.81 39.37,98.81 40.51,99.94 rg_BC3.10 44.45,99.94 44.7,100.2 ; 32,151 32,155.96 30.75,157.21 C64.1 ; 81.28,67.69 81.1,67.52 81.1,62.02 81.28,61.84 ; 81.28,67.69 80.14,68.83 76.45,68.83 75.31,67.69 72.64,67.69 72.12,67.17 71.26,67.17 ; 81.28,67.69 82.88,67.69 ; 59.69,77.6 59.69,72.64 60.64,71.69 60.64,70.61 60.39,70.36 ; v2(53.34,88.39) 46.35,88.39 44.7,90.04 ; 57.4,105.41 56.9,105.92 56.9,109.73 v2(57.66,110.49) 56.9,111.25 56.9,114.3 57.4,114.81 C57.1 ; 57.4,105.41 59.46,105.41 ; C28.1 43.45,136.89 44.7,135.64 44.7,130.68 ; C59.1 70.1,109.73 70.6,109.24 75.34,109.24 75.86,108.71 cd_NOT1.7 75.86,105.07 76.29,104.65 77.98,104.65 78.49,104.14 78.49,102.11 77.98,101.6 ; 60.69,63.79 60.69,66.92 61.47,67.69 63.63,67.69 ; 60.69,63.79 dc_BadPCINC.4 ; 60.69,63.79 60.69,63.14 ; v2(53.34,108.71) 46.35,108.71 44.7,110.36 ; C40.1 47.26,30.21 48.51,28.96 48.51,24 ; rg_DCC.12 40.88,64.77 ; 40.88,64.77 42.15,63.5 47.77,63.5 48.77,64.5 C35.2 52.56,64.5 53.34,65.28 v2(53.34,68.07) 46.35,68.07 44.7,69.72 ; 40.88,64.77 40.61,64.5 C34.2 36.07,64.5 35.07,63.5 29.45,63.5 28.17,64.77 ; lg_U2.7 105.41,66.55 ; 105.41,66.55 104.65,67.31 97.54,67.31 96.52,66.29 95.77,66.29 C100.1 ; 105.41,66.55 106.68,67.82 106.68,71.12 105.41,72.39 lg_U1.7 105.41,75.44 ; 78.49,95.52 78.49,101.09 77.98,101.6 ; 78.49,95.52 78.49,92.71 77.98,92.2 C60.1 74.66,91.17 74.42,90.93 62.74,90.93 60.96,92.71 59.46,92.71 ; 78.49,95.52 C76.1 85.34,95.52 85.77,95.09 dc_U1.7 ; 139.06,104.98 139.06,107.95 ; 139.06,107.95 131.32,107.95 130.32,106.95 C102.1 ; 139.06,107.95 139.7,107.95 140.34,107.31 ; C90.1 99.08,123.46 100.08,124.46 107.44,124.46 107.95,123.95 op_U4.7 ; C90.1 v2(98.04,120.65) ; C90.1 98.03,123.44 97.03,123.44 96.52,123.95 96.52,133.35 97.52,134.35 C75.1 102.22,134.35 102.49,134.62 mu_BOUT.10 ; C29.1 9.16,146.7 8.89,146.44 ; C99.1 95.77,75.18 96.52,75.18 97.54,76.2 104.65,76.2 105.41,75.44 ; 71.82,80.52 71.82,81.85 70.87,82.8 70.87,87.76 ; C21.1 9.16,126.38 8.89,126.11 ; 48.51,24 48.26,23.74 pc_BA0.10 44.06,23.74 42.93,22.61 39.24,22.61 38.1,23.74 ; 48.51,24 49.91,22.61 55.88,22.61 57.02,23.74 pc_BB0.10 60.96,23.74 61.21,24 ; 63.63,67.69 64.77,68.83 69.6,68.83 71.26,67.17 ; 63.63,67.69 64.02,67.31 v2(65.28,67.31) ; 44.7,110.36 44.7,115.32 43.45,116.57 C20.1 ; 44.7,110.36 44.45,110.1 rg_BC4.10 40.51,110.1 39.37,108.97 33.4,108.97 32,110.36 ; 32,69.72 32,74.68 30.75,75.93 C3.1 ; 32,69.72 33.4,68.33 39.37,68.33 40.51,69.46 rg_BC0.10 44.45,69.46 44.7,69.72 ; 8.89,85.47 rg_D1.1 ; 8.89,85.47 9.16,85.74 C5.1 ; 8.89,75.31 9.16,75.58 C1.1 ; 8.89,75.31 rg_D0.1 ; 8.89,75.31 9.07,75.14 9.07,69.64 8.89,69.46 ; 18.93,3.42 19.32,3.82 C52.1 ; 16.75,63.5 22.37,63.5 23.37,64.5 C33.2 27.91,64.5 28.17,64.77 ; 8.89,130.42 9.07,130.6 9.07,136.1 8.89,136.27 ; 8.89,130.42 7.29,130.42 ; 8.89,130.42 10.03,129.29 13.72,129.29 14.86,130.42 19.05,130.42 19.3,130.68 ; 8.89,99.94 10.03,98.81 13.72,98.81 14.86,99.94 rg_BA3.10 19.05,99.94 19.3,100.2 ; 8.89,99.94 rg_D3.10 ; 18.93,23.74 20.07,22.61 24.13,22.61 25.27,23.74 pc_D2.10 28.58,23.74 ; 18.93,23.74 17.45,23.74 ; 18.93,23.74 19.32,24.14 C51.1 ; dc_BadPCINC.3 60.69,63.14 ; 60.69,63.14 60.69,62.49 ; 69.02,125.03 69.85,124.21 69.85,119.5 69.34,118.99 65.66,118.99 64.52,117.86 ; 69.02,125.03 68.84,124.84 66.98,124.84 ; 69.02,125.03 68.85,125.21 C74.1 ; C37.1 6.67,63.23 6.94,63.5 rg_U1.7 ; C37.1 4.05,63.23 3.3,62.48 3.3,52.26 3.81,51.75 6.37,51.75 6.94,52.32 rg_U2.7 ; C37.1 4.83,68.83 5.46,69.46 rg_D0.10 8.89,69.46 ; v2(53.34,118.87) 46.35,118.87 44.7,120.52 ; C12.1 43.45,96.25 44.7,95 44.7,90.04 ; 8.89,140.58 9.07,140.76 9.07,146.26 8.89,146.44 ; 8.89,140.58 10.03,139.45 13.72,139.45 14.86,140.58 rg_BA7.10 19.05,140.58 19.3,140.84 ; 8.89,140.58 rg_D7.10 ; 102.87,106.41 99.56,106.41 99.3,106.68 bw_U1.12 99.3,110.22 99.57,110.49 C93.1 98.3,113.3 97.79,112.79 v2(97.79,111.76) ; 102.87,106.41 102.87,104.14 ; 102.87,106.41 C101.2 108.2,108.97 107.06,110.1 107.06,111.43 ; 28.58,23.74 29.21,24.38 29.21,29.46 28.21,30.46 C49.1 ; 28.58,23.74 29.72,22.61 34.04,22.61 35.17,23.74 pc_D0.10 38.1,23.74 ; dc_DB.10 81.28,88.01 ; 81.28,88.01 80.14,89.15 76.45,89.15 75.31,88.01 dc_BadB.10 71.12,88.01 70.87,87.76 ; v1(48.26,14.6) 48.26,15.51 ; 48.26,15.51 43.7,15.51 43.43,15.24 42.16,15.24 41.89,15.51 C47.1 35.56,15.51 ; 48.26,15.51 C46.1 60.96,15.51 ; 48.26,15.51 v1(48.26,19.68) ; C18.1 17.99,116.63 19.3,115.32 19.3,110.36 ; 102.87,104.14 103.19,103.81 bw_U1.19 ; 102.87,104.14 102.55,103.81 bw_U1.18 ; 8.89,136.27 rg_D6.1 ; 8.89,136.27 9.16,136.54 C25.1 ; 19.3,100.2 19.3,105.16 18.05,106.41 C14.1 ; io_BA0.10 127,91.05 ; 127,91.05 127,97.28 128.27,98.55 C87.1 ; 80.28,15.24 80.28,12.45 80.01,12.18 78.43,12.18 ; 80.28,15.24 v1(81.28,15.24) ; io_BOUT1.10 127.64,139.31 127,139.95 127,146.81 ; 64.77,117.6 v1(66.55,117.6) ; 64.77,117.6 64.52,117.86 ; 64.77,117.6 64.77,116.33 65.53,115.57 73.91,115.57 75.44,117.09 ; 80.71,70.36 80.71,71.43 81.28,72 ; 32,110.36 32,115.32 30.75,116.57 C19.1 ; 32,110.36 31.75,110.1 rg_BB4.10 27.81,110.1 26.67,108.97 20.7,108.97 19.3,110.36 ; 48.51,3.68 48.26,3.42 pc_BA1.10 44.06,3.42 42.93,2.29 39.24,2.29 38.1,3.42 ; 48.51,3.68 48.51,8.64 47.26,9.89 C43.1 ; 105.41,75.44 106.68,76.71 106.68,80.01 ; 44.7,100.2 46.35,98.55 v2(53.34,98.55) ; 44.7,100.2 44.7,105.16 43.45,106.41 C16.1 ; 44.7,140.84 46.35,139.19 v2(53.34,139.19) ; 44.7,140.84 44.45,140.58 rg_BC7.10 40.51,140.58 39.37,139.45 33.4,139.45 32,140.84 ; 64.52,117.86 60.83,117.86 59.69,118.99 ; db_B1.19 99.33,17.38 ; 99.33,17.38 99.33,15.24 ; 99.33,17.38 C108.1 ; C96.1 131.32,123.95 132.08,123.19 138.05,123.19 138.81,123.95 ar_BOUT.10 138.81,127.76 141.1,130.05 144.53,130.05 145.29,129.29 145.29,122.43 140.34,117.47 ; 8.89,146.44 7.29,146.44 ; 19.3,140.84 20.7,139.45 26.67,139.45 27.81,140.58 rg_BB7.10 31.75,140.58 32,140.84 ; 19.3,140.84 19.3,145.8 18.05,147.05 C30.1 ; 106.68,80.01 107.95,81.28 v2(108.71,81.28) ; 106.68,80.01 105.8,80.89 lg_BOUT1.10 105.8,84.7 105.41,85.09 100.33,85.09 99.33,84.09 C98.1 ; 32,79.88 32,84.84 30.75,86.09 C7.1 ; 32,79.88 31.75,79.62 rg_BB1.10 27.81,79.62 26.67,78.49 20.7,78.49 19.3,79.88 ; 32,79.88 33.4,78.49 39.37,78.49 40.51,79.62 rg_BC1.10 44.45,79.62 44.7,79.88 ; 32,140.84 32,145.8 30.75,147.05 C31.1 ; 132.97,54.1 133.73,53.34 138.43,53.34 139.45,54.36 140.45,54.36 C97.1 ; 132.97,54.1 lg_BOUT2.10 ; 81.28,61.84 80.71,61.27 80.71,60.2 ; 81.28,61.84 dc_D1.1 ; dc_DA.10 81.28,77.85 ; 81.28,77.85 81.1,77.68 81.1,72.18 81.28,72 ; 8.89,110.1 10.03,108.97 13.72,108.97 14.86,110.1 rg_BA4.10 19.05,110.1 19.3,110.36 ; 8.89,110.1 rg_D4.10 ; 4.83,23.11 8.38,23.11 9.13,23.86 C53.1 ; 44.7,120.52 44.45,120.26 rg_BC5.10 40.51,120.26 39.37,119.13 33.4,119.13 32,120.52 ; 44.7,120.52 44.7,125.48 43.45,126.73 C24.1 ; 32,90.04 33.4,88.65 39.37,88.65 40.51,89.78 rg_BC2.10 44.45,89.78 44.7,90.04 ; 44.12,58.6 43.43,57.91 31.86,57.91 31.42,58.35 ; 44.12,58.6 45.1,58.6 45.42,58.93 rg_DCC.20 ; 44.12,58.6 rg_DCC.18 ; 60.69,62.49 C78.1 ; 60.69,62.49 62.56,62.49 ; 99.33,15.24 v1(100.33,15.24) ; 99.33,15.24 99.33,12.45 99.06,12.18 97.48,12.18 ; 82.88,72 81.28,72 ; 32,120.52 31.75,120.26 rg_BB5.10 27.81,120.26 26.67,119.13 20.7,119.13 19.3,120.52 ; 60.96,15.51 v1(60.96,19.68) ; 60.96,15.51 v1(60.96,14.6) ; 44.7,69.72 44.7,74.68 43.45,75.93 C4.1 ; 91.69,135.65 91.69,135.89 91.19,136.4 85.01,136.4 83.23,134.62 ; 91.69,135.65 91.17,135.13 C81.2 91.17,124.75 91.69,124.22 ; 91.69,135.65 op_DC0.12 ; C6.1 18.05,86.09 19.3,84.84 19.3,79.88 ; ar_U1.8 140.34,107.31 ; 140.34,107.31 141.48,108.46 141.48,112.52 140.34,113.66 ar_U2.8 140.34,117.47 ; cd_AND1.7 77.98,101.6 ; C56.1 7.35,7.13 6.35,8.13 6.35,14.73 6.86,15.24 ; 127,146.81 v2(125.73,146.81) ; 127,146.81 C88.1 131.08,145.44 130.81,145.16 io_BOUT1.1 ; db_B3.19 140.97,15.5 141.24,15.77 C110.1 141.24,23.64 141.73,24.13 v2(141.73,25.4) ; 61.21,24 61.21,28.96 59.96,30.21 C41.1 ; 44.7,79.88 46.35,78.23 v2(53.34,78.23) ; 44.7,79.88 44.7,84.84 43.45,86.09 C8.1 ; 8.89,156.59 9.11,156.82 C62.1 ; 8.89,156.59 pg_D0.1 ; C22.1 18.05,126.73 19.3,125.48 19.3,120.52 ; st_BOUT1.10 98.18,95.25 97.91,95.52 92.97,95.52 ; op_U3.7 83.23,134.62 ; 71.26,67.17 71.26,62.6 72.12,61.74 C77.1 ; 8.89,126.11 9.07,125.94 9.07,120.44 8.89,120.26 ; 8.89,126.11 7.29,126.11 ; 140.34,117.47 139.7,118.11 131.32,118.11 130.32,117.11 C103.1 129.29,114.3 130.56,113.03 v2(131.32,113.03) ; 91.69,124.22 92.95,124.22 ; 91.69,124.22 91.17,123.7 C82.2 ; 35.56,15.51 v1(35.56,19.68) ; 35.56,15.51 32.78,15.51 32.51,15.24 30.99,15.24 30.72,15.51 C48.1 24.11,15.49 23.11,15.49 ; 35.56,15.51 v1(35.56,14.6) ; 75.44,117.09 77.98,114.55 77.98,107.19 80.77,104.39 80.77,103.38 81.28,102.87 op_U2.7 83.82,102.87 84.09,103.14 C85.1 ; 92.97,95.52 C95.1 90.68,93.47 90.93,93.22 v2(90.93,92.46) ; 92.97,95.52 st_BOUT1.2 ; 23.11,15.49 22.86,15.24 v1(22.86,14.6) ; 28.17,64.77 rg_DCB.12 ; 19.3,120.52 19.05,120.26 rg_BA5.10 14.86,120.26 13.72,119.13 10.03,119.13 8.89,120.26 ; hd_DOUT.1 77.47,36.44 ; 77.47,36.44 77.29,36.62 77.29,42.12 77.47,42.29 hd_DOUT.10 ; dc_BOP1.10 59.69,118.99 ; 59.69,118.99 60.96,120.26 60.96,124.46 59.96,125.46 C73.1 ; 8.89,120.26 rg_D5.10 ; 6.86,15.24 pc_U6.7 ; 31.42,58.35 rg_DCB.18
  Top Layer w0.508: 71.12,153.67 C107.2 ; 71.12,153.67 71.12,158.75 ; 71.12,153.67 C106.1 ; db_HA.2 db_HB.2 db_HRES.2
  Bottom Layer w0.254: 99.06,24.13 100.33,22.86 v1(100.33,15.24) ; 99.06,24.13 99.06,25.4 ; 99.06,24.13 97.79,22.86 92.71,22.86 85.09,15.24 v1(81.28,15.24) ; v1(60.96,14.6) 61.59,14.6 62.87,13.33 ; v1(60.96,14.6) 60.96,16.89 63.75,19.68 65.2,19.68 ; v1(60.96,14.6) pc_U1.11 ; 27.1,19.68 25.65,19.68 22.86,16.89 v1(22.86,14.6) ; 124.46,111.76 v2(97.79,111.76) 97.79,108.46 90.93,101.6 v2(90.93,92.46) 90.93,91.95 92.71,90.17 97.79,90.17 100.08,92.46 v2(101.09,92.46) ; pc_U1.8 63.5,12.06 62.87,12.7 62.87,13.33 ; v2(131.32,113.03) 124.46,113.03 ; 61.62,102.51 63.1,102.51 ; 63.1,102.51 63.5,102.11 C61.1 ; 63.1,102.51 63.83,103.24 63.83,108.28 63.25,108.86 59.29,108.86 ; 52.5,19.68 51.05,19.68 48.26,16.89 v1(48.26,14.6) ; 145.03,27.18 145.29,26.92 v2(145.29,25.91) ; 24.77,13.33 26.03,14.6 pc_U4.6 ; 24.77,13.33 24.77,12.7 25.4,12.06 pc_U4.8 ; 24.77,13.33 23.5,14.6 v1(22.86,14.6) ; pc_U4.11 v1(22.86,14.6) ; v1(48.26,14.6) 48.9,14.6 50.17,13.33 ; v1(48.26,14.6) pc_U2.11 ; pc_U3.8 38.1,12.06 37.47,12.7 37.47,13.33 ; R16.2 R15.2 R14.2 R13.2 R12.2 R11.2 R10.2 R9.2 R8.2 R7.2 R6.2 R5.2 R4.2 R3.2 R2.2 R1.2 3.3,32.26 v2(3.3,29.72) ; v2(53.34,118.87) 54.61,118.87 ; 46.56,19.68 v1(48.26,19.68) ; pc_U2.6 51.44,14.6 50.17,13.33 ; v2(108.71,81.28) 118.11,81.28 122.43,76.96 124.46,76.96 ; pc_U3.6 38.73,14.6 37.47,13.33 ; v1(35.56,14.6) 35.56,16.89 38.35,19.68 39.8,19.68 ; v1(35.56,14.6) pc_U3.11 ; v1(35.56,14.6) 36.2,14.6 37.47,13.33 ; 62.87,13.33 pc_U1.7 ; v2(53.34,68.07) 54.61,68.07 ; pc_U2.8 50.8,12.06 50.17,12.7 50.17,13.33 ; v2(53.34,98.55) 54.61,98.55 ; 54.61,68.58 62.23,68.58 63.5,67.31 v2(65.28,67.31) ; v2(125.73,146.81) 124.46,146.81 ; 59.26,19.68 v1(60.96,19.68) ; v2(53.34,78.23) 54.61,78.23 ; 54.61,110.49 v2(57.66,110.49) 59.29,108.86 ; v2(53.34,129.03) 54.61,129.03 ; 59.29,108.86 59.29,107.97 59.69,107.57 61.75,107.57 ; R22.2 96,27.19 96.52,26.67 H3.3 ; R47.1 146.3,133.05 ; v2(53.34,108.71) 54.61,108.71 ; v2(55.88,88.9) 54.61,88.9 ; v2(141.73,25.4) 141.73,27.18 ; v1(130.05,58.42) 124.46,58.42 ; v2(53.34,88.39) 54.61,88.39 ; 33.86,19.68 v1(35.56,19.68) ; v2(53.34,139.19) 54.61,139.19 ; R21.1 R20.1 R19.1 R18.1 R17.1 66.55,118.86 v1(66.55,117.6) 54.61,117.6 ; v2(125.73,88.39) 124.46,88.39 ; 124.46,125.73 111.51,125.73 107.7,121.92 101.6,121.92 100.33,120.65 v2(98.04,120.65) ; 21.16,19.68 v1(22.86,19.68) ; v2(55.88,78.74) 54.61,78.74
  Bottom Layer w0.305: 138.43,27.18 138.43,21.59 136.19,19.35 R44.1 R43.1 ; R39.1 R40.1 R41.1 R42.1 R43.1 ; R27.1 125.48,14.27 ; R27.1 R28.1 R29.1 R30.1 R31.1 R32.1 R33.1 R34.1 R35.1 R36.1 R37.1 R38.1 ; R27.1 R26.1 R25.1 R24.1 R23.1 ; 125.48,14.27 125.48,16.26 127,17.78 R43.1 ; 125.48,14.27 R46.1 ; 125.48,14.27 R45.1
  Bottom Layer w0.508: 124.46,137.16 138.43,137.16 139.7,138.43 io_H1.2 ; 124.46,137.16 124.46,160.02 142.24,160.02 146.3,155.96 146.3,28.45 145.03,27.18 106.68,27.18 ; 124.46,137.16 124.46,78.74 ; v2(53.34,151.13) 53.85,151.13 54.61,150.37 ; H4.2 142.24,44.45 140.97,45.72 125.73,45.72 124.46,46.99 124.46,78.74 ; 3.3,32.26 2.29,33.27 2.29,41.91 4.32,43.94 17.78,43.94 19.81,41.91 41.66,41.91 54.61,54.86 54.61,68.07 ; 124.46,78.74 138.43,78.74 139.7,80.01 io_H0.2 ; H1.3 105.41,150.37 ; H3.3 104.9,25.4 106.68,27.18 ; 106.68,27.18 db_HRES.2
  Bottom Layer w0.762: 71.12,150.37 54.61,150.37 54.61,68.07 ; 71.12,150.37 102.87,150.37 ; 71.12,150.37 71.12,158.75 ; 102.87,150.37 102.87,153.48 98.87,157.48 ; 102.87,150.37 108.46,150.37 118.11,160.02 124.46,160.02 ; 98.87,157.48 96.83,155.44 J1.3 ; 98.87,157.48 J1.2
